# EAGLE design Altera_Sample_schematic (EAGLE 6.4)

## Sheet 1 of 5
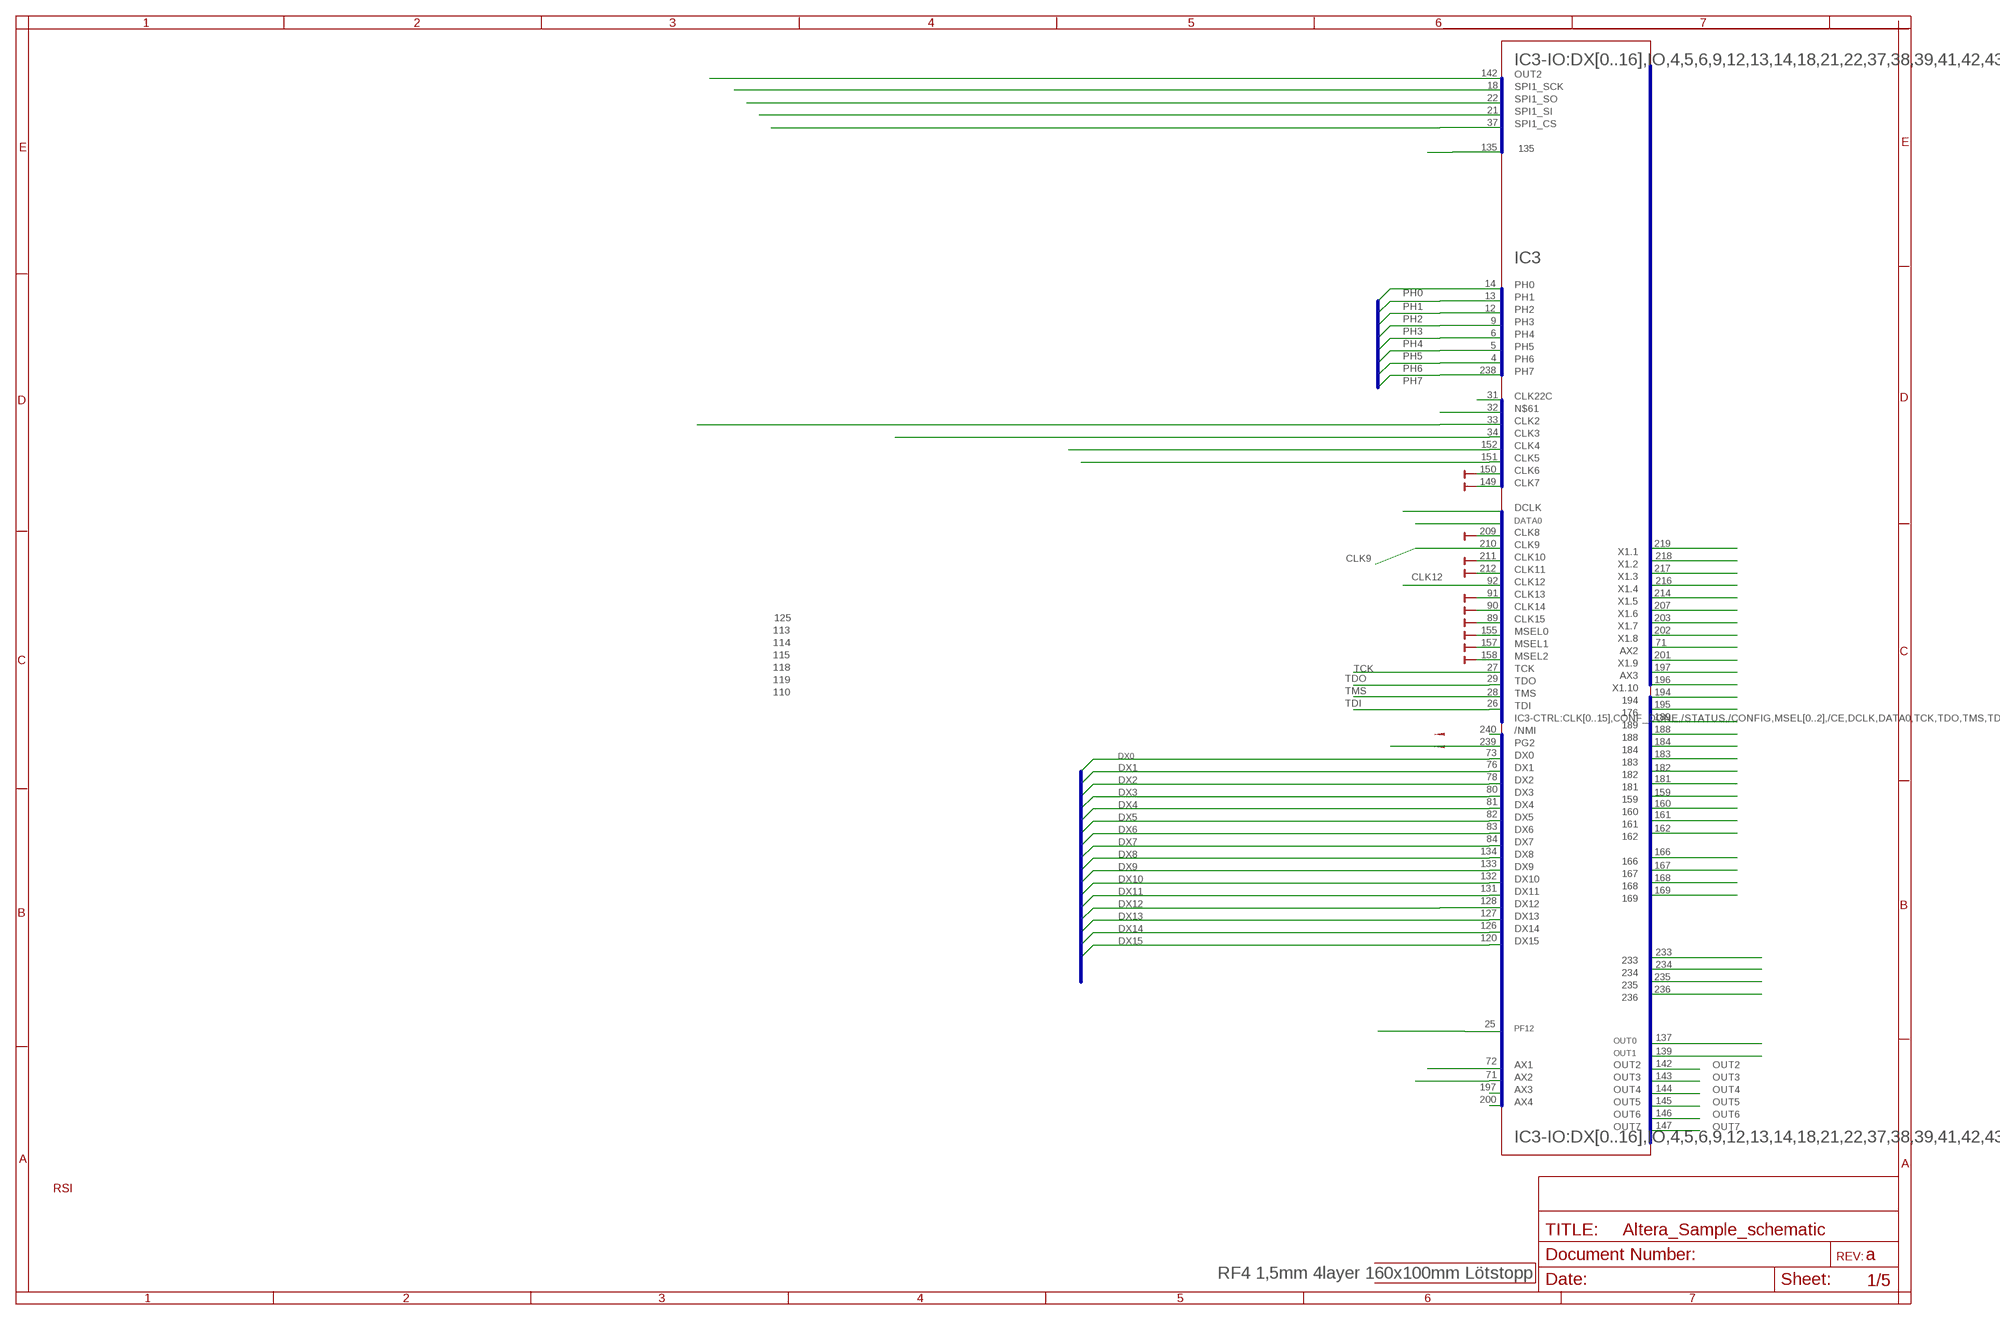
[diagram p0: schematic, sheet 1]

### Parts
PCB  RF4 1,5mm 4layer 160x100mm Lötstopp  PCB  [PCB]

### Buses
DATA:D[0..15]
SPI1:CS,SCK,SI,SO,PH[0..7]
IC3-IO:DX[0..16],IO,4,5,6,9,12,13,14,18,21,22,37,38,39,41,42,43,44,45,46,49,50,51,52,55,56,57,63,64,65,68,69,70,71,72,73,76,78,80,81,82,83,84,87,88,93,94,95,98,99,100,103,106,107,108,109,110,111,112,113,114,117,118,119,120,126,127,128,131,132,133,134,135,137,139,142,148,159,160,161,162,164,166,167,168,169,171,173,176,177,181,182,183,184,185,186,187,188,189,194,195,196,197,200,201,202,203,207,214,216,217,218,219,221,223,224,226,230,231,232,233,234,235,236,237,238,239,240
IC3-CTRL:CLK[0..15],CONF_DONE,/STATUS,/CONFIG,MSEL[0..2],/CE,DCLK,DATA0,TCK,TDO,TMS,TDI
IC3-PH:PH[0..7]

### Notes on the sheet
- 142
- 18
- 22
- 21
- 37
- 135
- IC3
- 14
- 13
- 12
- 9
- 6
- 5
- 4
- 238
- 31
- 32
- 33
- 34
- 152
- 151
- 150
- 149
- 209
- 210 | 219
- 211 | 218
- 212 | 217
- 92 | 216
- 91 | 214
- 90 | 207
- 125 | 89 | 203
- 113 | 155 | 202
- 114 | 157 | 71
- 115 | 158 | 201
- 118 | 27 | 197
- 119 | 29 | 196
- 110 | 28 | 194
- 26 | 195
- 189
- 240 | 188
- 239 | 184
- 73 | 183
- 76
- 182
- 78 | 181
- 80
- 159
- 81 | 160
- 82 | 161
- 83 | 162
- 84
- 134 | 166
- 133 | 167
- 132 | 168
- 131 | 169
- 128
- 127
- 126
- 120
- 233
- 234
- 235
- 236
- 25
- 137
- 139
- 72 | 142
- 71 | 143
- 197 | 144
- 200 | 145
- 146
- 147
- RSI

## Sheet 2 of 5
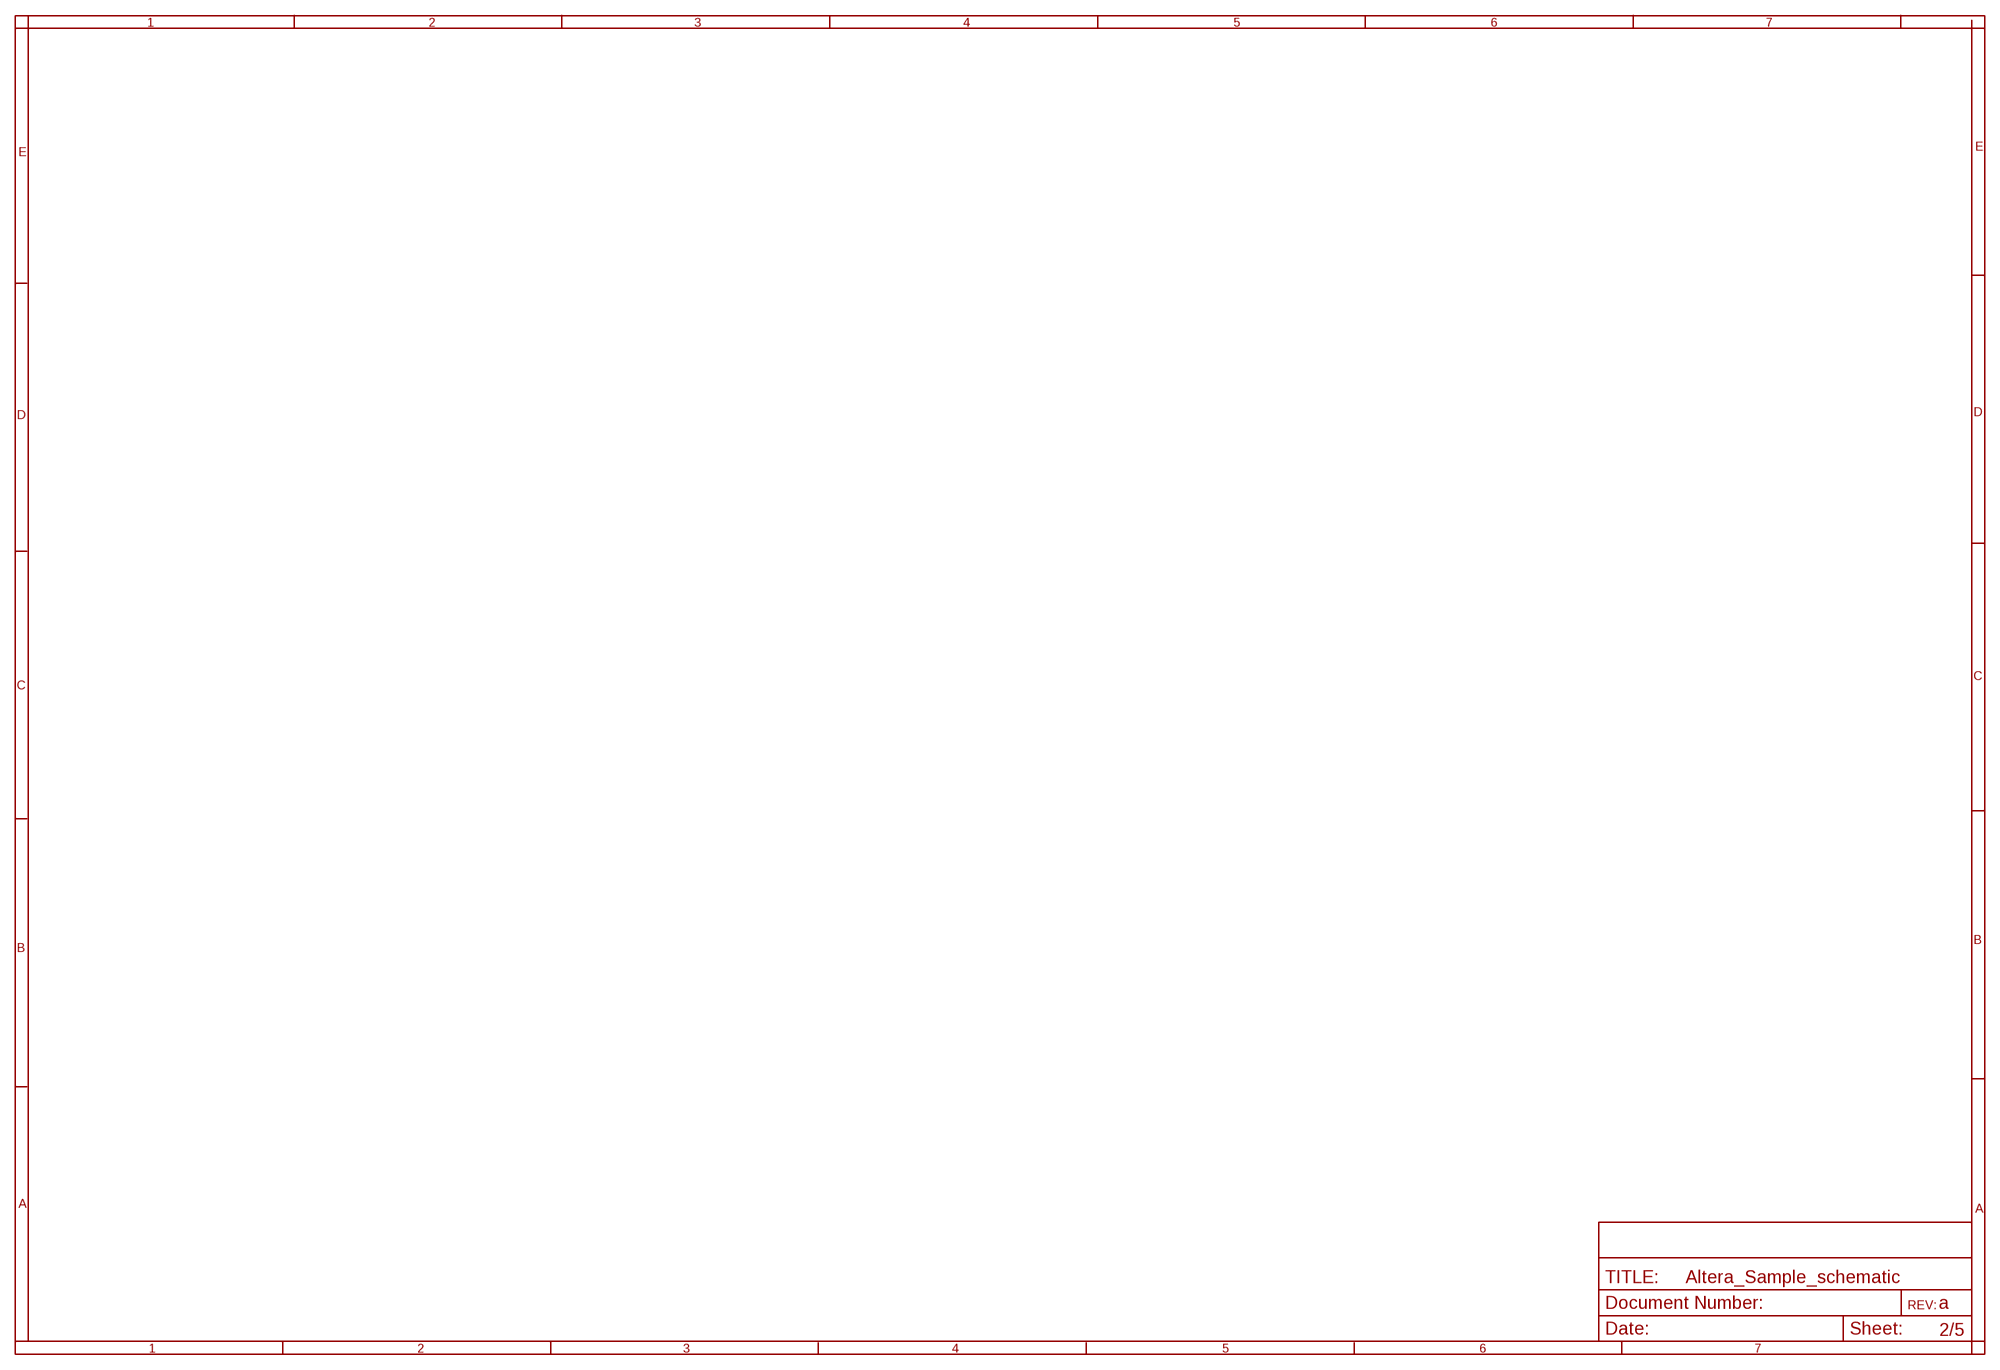
[diagram p1: schematic, sheet 2]

## Sheet 3 of 5
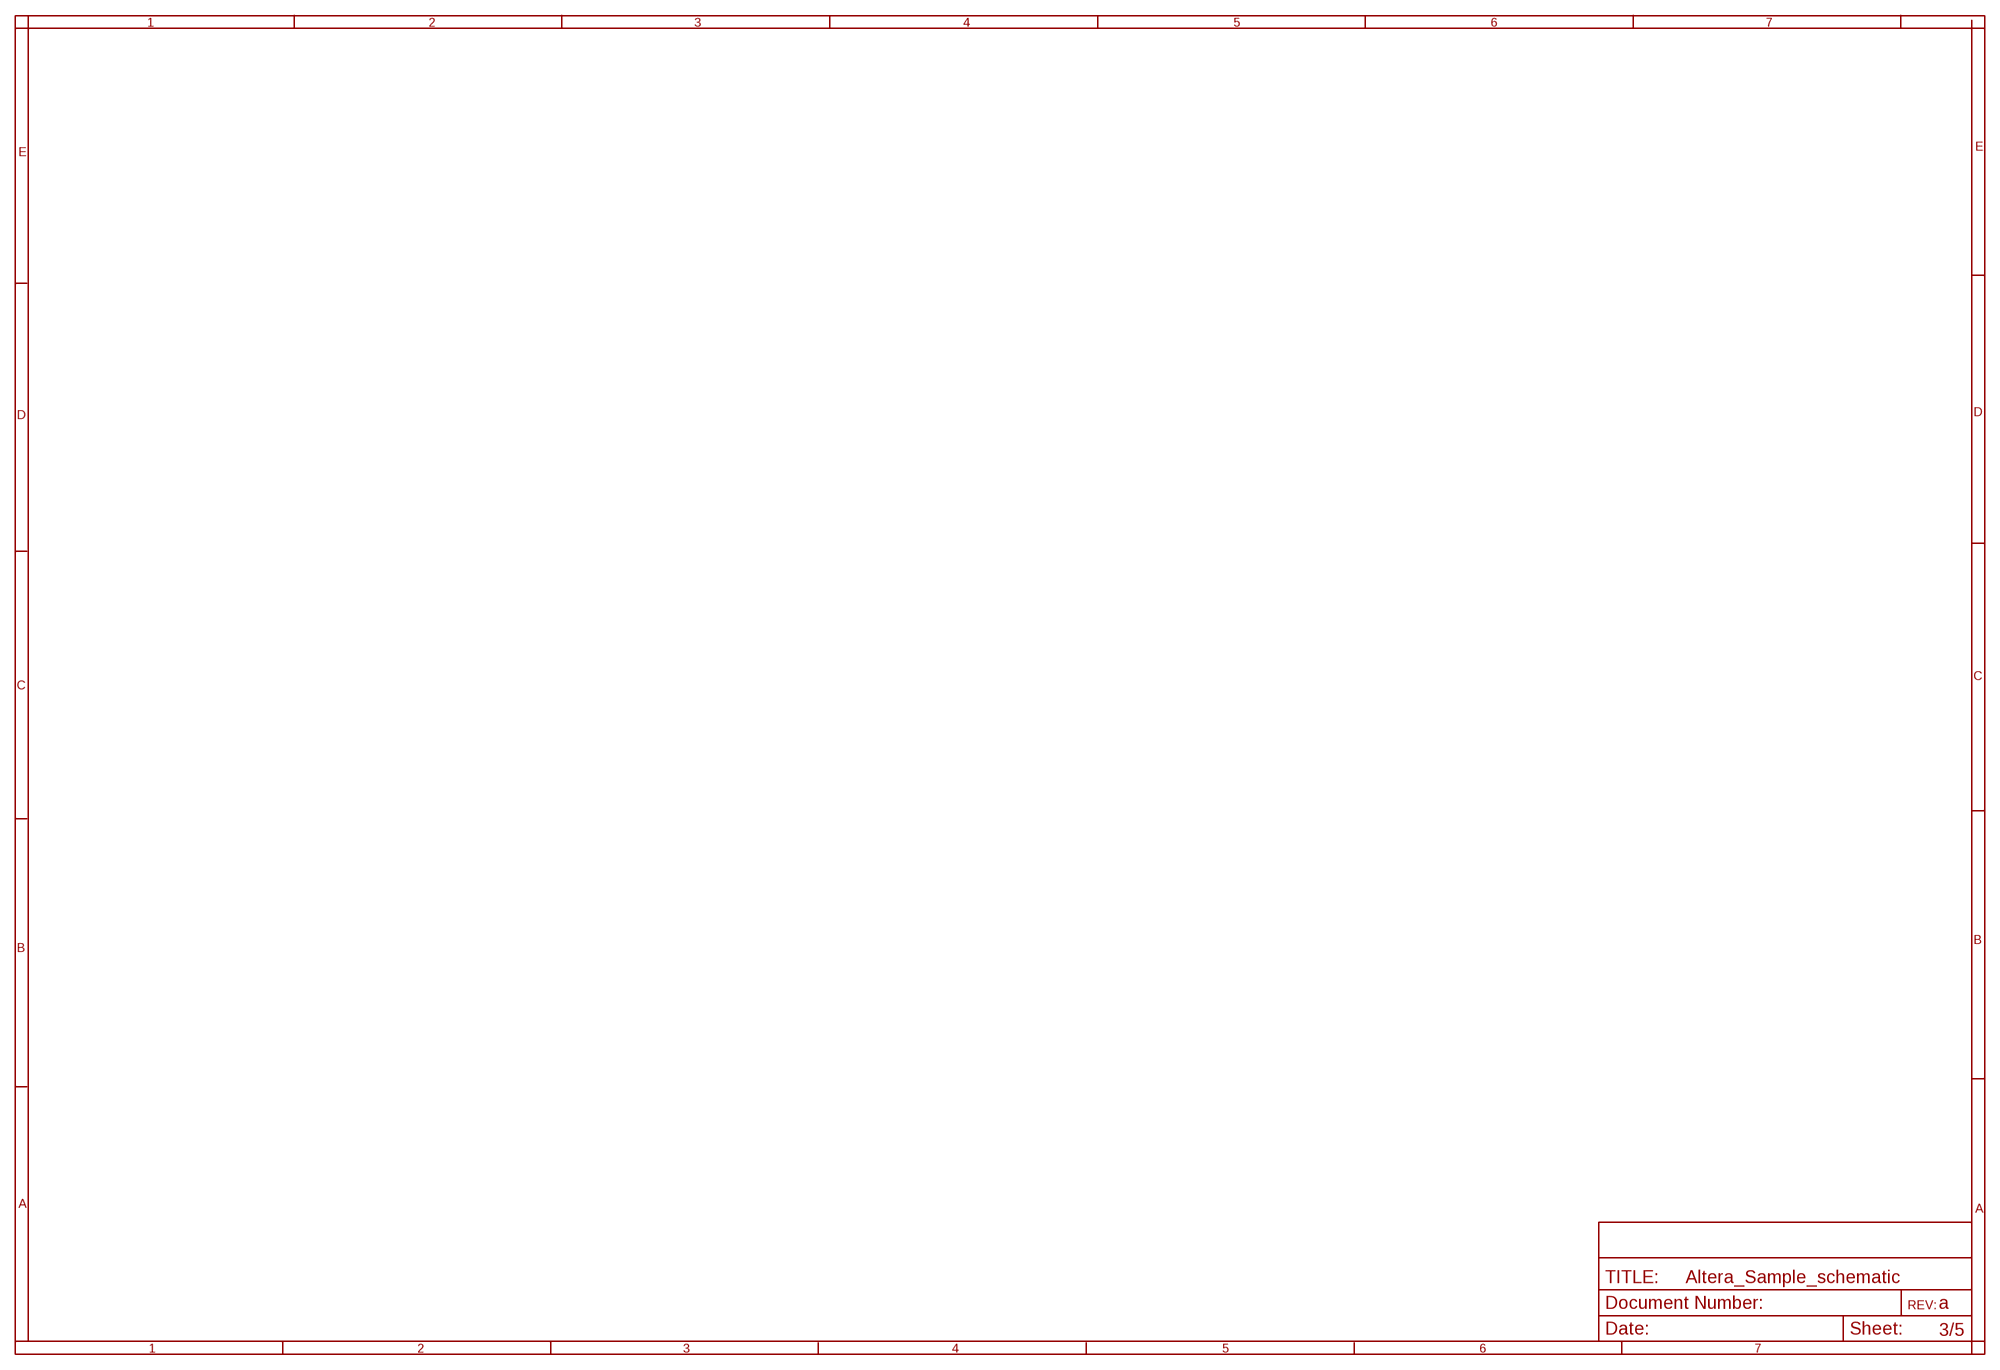
[diagram p2: schematic, sheet 3]

## Sheet 4 of 5
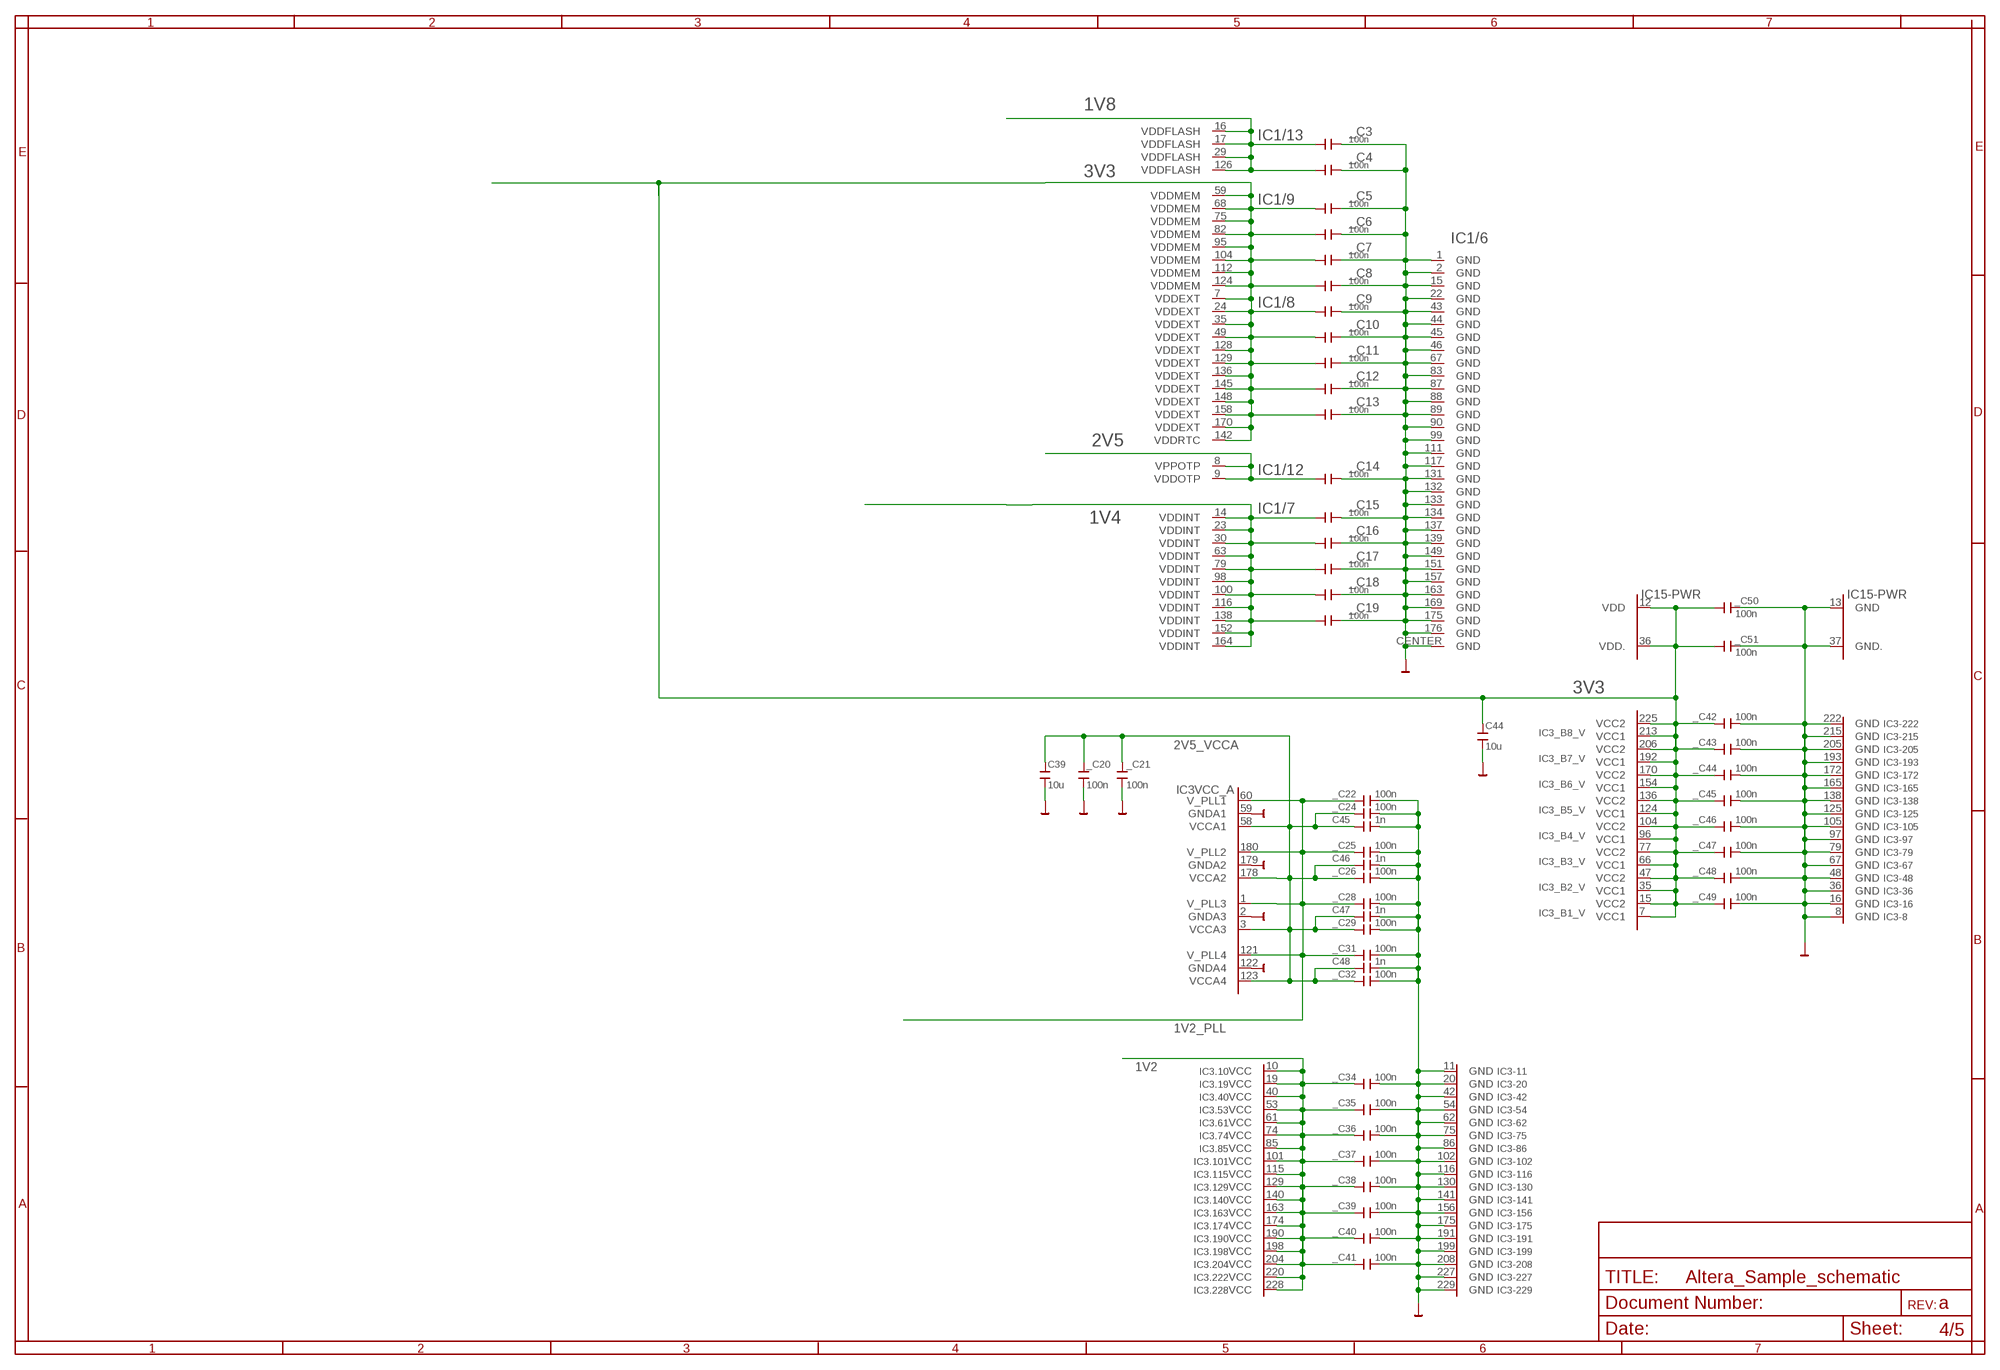
[diagram p3: schematic, sheet 4]

### Parts
_C3  100n  C-EUC0805  [C0805]
_C4  100n  C-EUC0805  [C0805]
_C5  100n  C-EUC0805  [C0805]
_C6  100n  C-EUC0805  [C0805]
_C7  100n  C-EUC0805  [C0805]
_C8  100n  C-EUC0805  [C0805]
_C9  100n  C-EUC0805  [C0805]
_C10  100n  C-EUC0805  [C0805]
_C11  100n  C-EUC0805  [C0805]
_C12  100n  C-EUC0805  [C0805]
_C13  100n  C-EUC0805  [C0805]
_C14  100n  C-EUC0805  [C0805]
_C15  100n  C-EUC0805  [C0805]
_C16  100n  C-EUC0805  [C0805]
_C17  100n  C-EUC0805  [C0805]
_C18  100n  C-EUC0805  [C0805]
_C19  100n  C-EUC0805  [C0805]
_C20  100n  C-EUC0805  [C0805]
_C21  100n  C-EUC0805  [C0805]
_C22  100n  C-EUC0805  [C0805]
_C24  100n  C-EUC0805  [C0805]
_C25  100n  C-EUC0805  [C0805]
_C26  100n  C-EUC0805  [C0805]
_C28  100n  C-EUC0805  [C0805]
_C29  100n  C-EUC0805  [C0805]
_C31  100n  C-EUC0805  [C0805]
_C32  100n  C-EUC0805  [C0805]
_C34  100n  C-EUC0805  [C0805]
_C35  100n  C-EUC0805  [C0805]
_C36  100n  C-EUC0805  [C0805]
_C37  100n  C-EUC0805  [C0805]
_C38  100n  C-EUC0805  [C0805]
_C39  100n  C-EUC0805  [C0805]
_C40  100n  C-EUC0805  [C0805]
_C41  100n  C-EUC0805  [C0805]
_C42  100n  C-EUC0805  [C0805]
_C43  100n  C-EUC0805  [C0805]
_C44  100n  C-EUC0805  [C0805]
_C45  100n  C-EUC0805  [C0805]
_C46  100n  C-EUC0805  [C0805]
_C47  100n  C-EUC0805  [C0805]
_C48  100n  C-EUC0805  [C0805]
_C49  100n  C-EUC0805  [C0805]
_C50  100n  C-EUC0805  [C0805]
_C51  100n  C-EUC0805  [C0805]
C39  10u  C-EUC1210K  [C1210K]
C44  10u  C-EUC1210K  [C1210K]
C45  1n  C-EUC0805  [C0805]
C46  1n  C-EUC0805  [C0805]
C47  1n  C-EUC0805  [C0805]
C48  1n  C-EUC0805  [C0805]
IC1  ADSP-BF514_PART  [LQFP-176+GND]
IC3  EP3C25-Q240-IO131  [PQFP240]
IC15  IS62WV102416ALL  [TSOP1-12X20]

### Nets
1V2: _C34.2 _C35.2 _C36.2 _C37.2 _C38.2 _C39.2 _C40.2 _C41.2 IC3.10(.10:VCC) IC3.19(.19:VCC) IC3.40(.40:VCC) IC3.53(.53:VCC) IC3.61(.61:VCC) IC3.74(.74:VCC) IC3.85(.85:VCC) IC3.101(.101:VCC) IC3.115(.115:VCC) IC3.129(.129:VCC) IC3.140(.140:VCC) IC3.163(.163:VCC) IC3.174(.174:VCC) IC3.190(.190:VCC) IC3.198(.198:VCC) IC3.204(.204:VCC) IC3.220(.222:VCC) IC3.228(.228:VCC)
1V2_PLL: _C22.2 _C25.2 _C28.2 _C31.2 IC3.1(VCC_A:V_PLL3) IC3.60(VCC_A:V_PLL1) IC3.121(VCC_A:V_PLL4) IC3.180(VCC_A:V_PLL2)
1V4: _C15.1 _C16.1 _C17.1 _C18.1 _C19.1 IC1.14(/7:VDDINT) IC1.23(/7:VDDINT) IC1.30(/7:VDDINT) IC1.63(/7:VDDINT) IC1.79(/7:VDDINT) IC1.98(/7:VDDINT) IC1.100(/7:VDDINT) IC1.116(/7:VDDINT) IC1.138(/7:VDDINT) IC1.152(/7:VDDINT) IC1.164(/7:VDDINT)
1V8: _C3.1 _C4.1 IC1.16(/13:VDDFLASH) IC1.17(/13:VDDFLASH) IC1.29(/13:VDDFLASH) IC1.126(/13:VDDFLASH)
2V5: _C14.1 IC1.8(/12:VPPOTP) IC1.9(/12:VDDOTP)
2V5_VCCA: _C20.2 _C21.2 _C24.2 _C26.2 _C29.2 _C32.2 C39.2 C45.2 C46.2 C47.2 C48.2 IC3.3(VCC_A:VCCA3) IC3.58(VCC_A:VCCA1) IC3.123(VCC_A:VCCA4) IC3.178(VCC_A:VCCA2)
3V3: _C5.1 _C6.1 _C7.1 _C8.1 _C9.1 _C10.1 _C11.1 _C12.1 _C13.1 _C42.2 _C43.2 _C44.2 _C45.2 _C46.2 _C47.2 _C48.2 _C49.2 _C50.1 _C51.1 C44.2 IC1.7(/8:VDDEXT) IC1.24(/8:VDDEXT) IC1.35(/8:VDDEXT) IC1.49(/8:VDDEXT) IC1.59(/9:VDDMEM) IC1.68(/9:VDDMEM) IC1.75(/9:VDDMEM) IC1.82(/9:VDDMEM) IC1.95(/9:VDDMEM) IC1.104(/9:VDDMEM) IC1.112(/9:VDDMEM) IC1.124(/9:VDDMEM) IC1.128(/8:VDDEXT) IC1.129(/8:VDDEXT) IC1.136(/8:VDDEXT) IC1.142(/12:VDDRTC) IC1.145(/8:VDDEXT) IC1.148(/8:VDDEXT) IC1.158(/8:VDDEXT) IC1.170(/8:VDDEXT) IC3.7(_B1_V:VCC1) IC3.15(_B1_V:VCC2) IC3.35(_B2_V:VCC1) IC3.47(_B2_V:VCC2) IC3.66(_B3_V:VCC1) IC3.77(_B3_V:VCC2) IC3.96(_B4_V:VCC1) IC3.104(_B4_V:VCC2) IC3.124(_B5_V:VCC1) IC3.136(_B5_V:VCC2) IC3.154(_B6_V:VCC1) IC3.170(_B6_V:VCC2) IC3.192(_B7_V:VCC1) IC3.206(_B7_V:VCC2) IC3.213(_B8_V:VCC1) IC3.225(_B8_V:VCC2) IC15.12(-PWR:VDD) IC15.36(-PWR:VDD.)
GND: _C3.2 _C4.2 _C5.2 _C6.2 _C7.2 _C8.2 _C9.2 _C10.2 _C11.2 _C12.2 _C13.2 _C14.2 _C15.2 _C16.2 _C17.2 _C18.2 _C19.2 _C20.1 _C21.1 _C22.1 _C24.1 _C25.1 _C26.1 _C28.1 _C29.1 _C31.1 _C32.1 _C34.1 _C35.1 _C36.1 _C37.1 _C38.1 _C39.1 _C40.1 _C41.1 _C42.1 _C43.1 _C44.1 _C45.1 _C46.1 _C47.1 _C48.1 _C49.1 _C50.2 _C51.2 C39.1 C44.1 C45.1 C46.1 C47.1 C48.1 IC1.1(/6:GND) IC1.2(/6:GND) IC1.15(/6:GND) IC1.22(/6:GND) IC1.43(/6:GND) IC1.44(/6:GND) IC1.45(/6:GND) IC1.46(/6:GND) IC1.67(/6:GND) IC1.83(/6:GND) IC1.87(/6:GND) IC1.88(/6:GND) IC1.89(/6:GND) IC1.90(/6:GND) IC1.99(/6:GND) IC1.111(/6:GND) IC1.117(/6:GND) IC1.131(/6:GND) IC1.132(/6:GND) IC1.133(/6:GND) IC1.134(/6:GND) IC1.137(/6:GND) IC1.139(/6:GND) IC1.149(/6:GND) IC1.151(/6:GND) IC1.157(/6:GND) IC1.163(/6:GND) IC1.169(/6:GND) IC1.175(/6:GND) IC1.176(/6:GND) IC1.CENTER(/6:GND) IC3.2(VCC_A:GNDA3) IC3.8(-8:GND) IC3.11(-11:GND) IC3.16(-16:GND) IC3.20(-20:GND) IC3.36(-36:GND) IC3.42(-42:GND) IC3.48(-48:GND) IC3.54(-54:GND) IC3.59(VCC_A:GNDA1) IC3.62(-62:GND) IC3.67(-67:GND) IC3.75(-75:GND) IC3.79(-79:GND) IC3.86(-86:GND) IC3.97(-97:GND) IC3.102(-102:GND) IC3.105(-105:GND) IC3.116(-116:GND) IC3.122(VCC_A:GNDA4) IC3.125(-125:GND) IC3.130(-130:GND) IC3.138(-138:GND) IC3.141(-141:GND) IC3.156(-156:GND) IC3.165(-165:GND) IC3.172(-172:GND) IC3.175(-175:GND) IC3.179(VCC_A:GNDA2) IC3.191(-191:GND) IC3.193(-193:GND) IC3.199(-199:GND) IC3.205(-205:GND) IC3.208(-208:GND) IC3.215(-215:GND) IC3.222(-222:GND) IC3.227(-227:GND) IC3.229(-229:GND) IC15.13(-PWR:GND) IC15.37(-PWR:GND.) ; also sheet 5
Unconnected: IC1.3(/3:PF9) IC1.4(/3:PF8) IC1.5(/3:PF7) IC1.6(/3:PF6) IC1.10(/3:PF5) IC1.11(/3:PF4) IC1.12(/3:PF3) IC1.13(/3:PF2) IC1.18(/3:PF1) IC1.19(/3:PF0) IC1.20(/4:PG15) IC1.21(/4:PG14) IC1.25(/4:PG13) IC1.26(/4:PG12) IC1.27(/4:PG11) IC1.28(/4:PG10) IC1.31(/4:PG9) IC1.32(/4:PG8) IC1.33(/4:PG7) IC1.34(/4:PG6) IC1.36(/4:PG5) IC1.37(/4:PG4) IC1.38(/4:PG3) IC1.39(/4:PG2) IC1.47(/4:PG1) IC1.48(/4:PG0) IC1.50(/11:TDO) IC1.51(/11:/EMU) IC1.52(/11:TDI) IC1.53(/11:TCK) IC1.54(/11:/TRST) IC1.55(/11:TMS) IC1.56(/2:D15) IC1.57(/2:D14) IC1.58(/2:D13) IC1.60(/2:D12) IC1.61(/2:D11) IC1.62(/2:D10) IC1.64(/2:D9) IC1.65(/2:D8) IC1.66(/2:D7) IC1.69(/2:D6) IC1.70(/2:D5) IC1.71(/2:D4) IC1.72(/2:D3) IC1.73(/2:D2) IC1.74(/2:D1) IC1.76(/2:D0) IC1.77(/1:A19) IC1.78(/1:A18) IC1.80(/1:A17) IC1.81(/1:A16) IC1.84(/1:A15) IC1.85(/1:A14) IC1.86(/1:A13) IC1.91(/1:A12) IC1.92(/1:A11) IC1.93(/1:A10) IC1.94(/1:A9) IC1.96(/1:A8) IC1.97(/1:A7) IC1.101(/1:A6) IC1.102(/1:A5) IC1.103(/1:A4) IC1.105(/1:A3) IC1.106(/1:A2) IC1.107(/1:A1) IC1.108(/11:/ABE1) IC1.109(/11:/ABE0) IC1.110(/11:SA10) IC1.113(/11:/SWE) IC1.114(/11:/SCAS) IC1.115(/11:/SRAS) IC1.118(/11:/SMS) IC1.119(/11:SCKE) IC1.120(/11:/AMS1) IC1.121(/11:/ARE) IC1.122(/11:/AWE) IC1.123(/11:/AMS0) IC1.125(/11:CLKOUT) IC1.127(/11:NC) IC1.130(/11:EXT_WAKE) IC1.135(/11:/PG) IC1.140(/11:RTXO) IC1.141(/11:RTXI) IC1.143(/11:CLKIN) IC1.144(/11:XTAL) IC1.146(/11:/RESET) IC1.147(/11:/NMI) IC1.150(/11:CLKBUF) IC1.153(/5:PH7) IC1.154(/5:PH6) IC1.155(/5:PH5) IC1.156(/5:PH4) IC1.159(/5:PH3) IC1.160(/5:PH2) IC1.161(/5:PH1) IC1.162(/5:PH0) IC1.165(/3:PF15) IC1.166(/3:PF14) IC1.167(/3:PF13) IC1.168(/3:PF12) IC1.171(/3:PF11) IC1.172(/11:SDA) IC1.173(/11:SCL) IC1.174(/3:PF10)

### Notes on the sheet
- IC1/13
- IC1/9
- IC1/6
- IC1/8
- IC1/12
- IC1/7

## Sheet 5 of 5
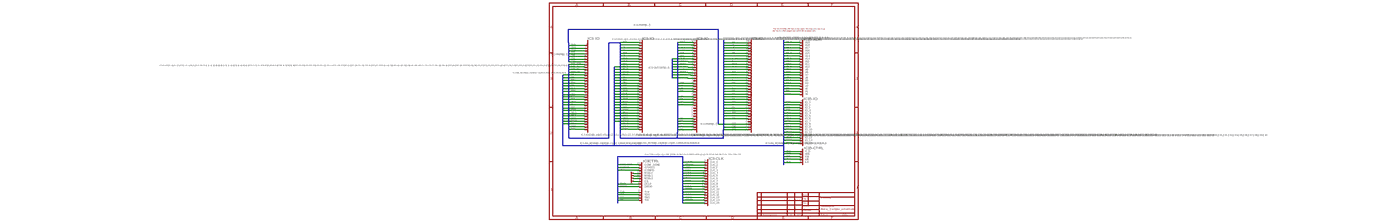
[diagram p4: schematic, sheet 5, overview]
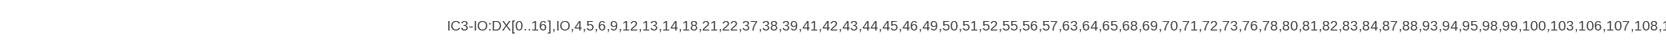
[diagram p5: schematic, sheet 5, part 1 of 4]
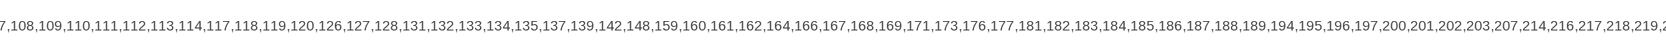
[diagram p6: schematic, sheet 5, part 2 of 4]
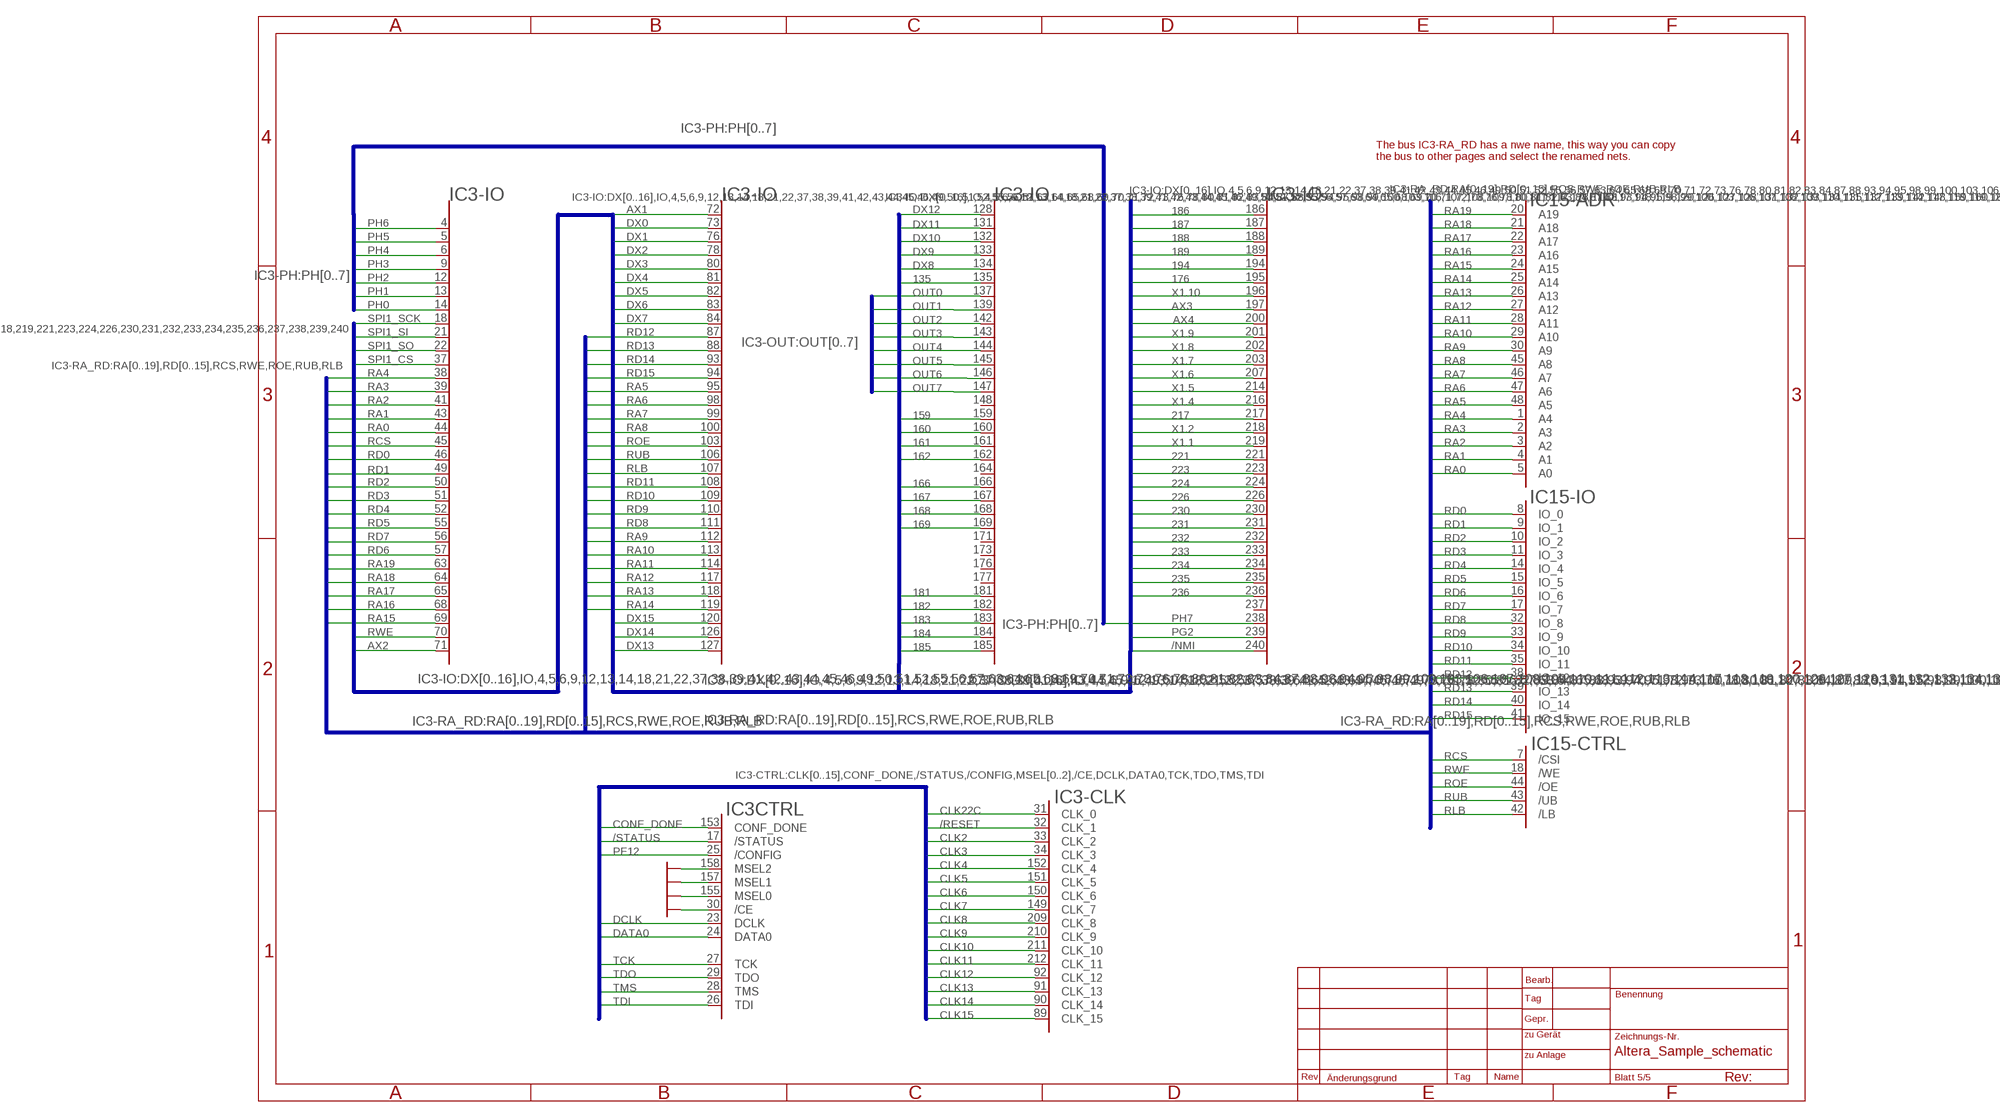
[diagram p7: schematic, sheet 5, part 3 of 4]
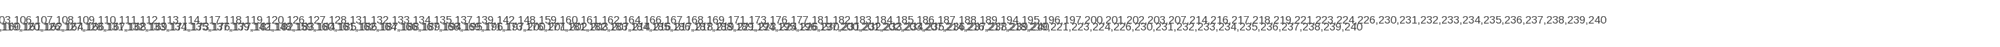
[diagram p8: schematic, sheet 5, part 4 of 4]

### Nets
135: IC3.135(IO_71) ; also sheet 1
159: IC3.159(IO_81) ; also sheet 1
160: IC3.160(IO_82) ; also sheet 1
161: IC3.161(IO_83) ; also sheet 1
162: IC3.162(IO_84) ; also sheet 1
166: IC3.166(IO_86) ; also sheet 1
167: IC3.167(IO_87) ; also sheet 1
168: IC3.168(IO_88) ; also sheet 1
169: IC3.169(IO_89) ; also sheet 1
176: IC3.195(IO_104) ; also sheet 1
181: IC3.181(IO_94) ; also sheet 1
182: IC3.182(IO_95) ; also sheet 1
183: IC3.183(IO_96) ; also sheet 1
184: IC3.184(IO_97) ; also sheet 1
185: IC3.185(IO_98)
186: IC3.186(IO_99)
187: IC3.187(IO_100)
188: IC3.188(IO_101) ; also sheet 1
189: IC3.189(IO_102) ; also sheet 1
194: IC3.194(IO_103) ; also sheet 1
217: IC3.217(IO_114)
221: IC3.221(IO_117)
223: IC3.223(IO_118)
224: IC3.224(IO_119)
226: IC3.226(IO_120)
230: IC3.230(IO_121)
231: IC3.231(IO_122)
232: IC3.232(IO_123)
233: IC3.233(IO_124) ; also sheet 1
234: IC3.234(IO_125) ; also sheet 1
235: IC3.235(IO_126) ; also sheet 1
236: IC3.236(IO_127) ; also sheet 1
/NMI: IC3.240(IO_131) ; also sheet 1
/RESET: IC3.32(-CLK:CLK_1)
/STATUS: IC3.17(CTRL:/STATUS)
AX1: IC3.72(IO_33) ; also sheet 1
AX2: IC3.71(IO_32) ; also sheet 1
AX3: IC3.197(IO_106) ; also sheet 1
AX4: IC3.200(IO_107) ; also sheet 1
CLK2: IC3.33(-CLK:CLK_2) ; also sheet 1
CLK3: IC3.34(-CLK:CLK_3) ; also sheet 1
CLK4: IC3.152(-CLK:CLK_4) ; also sheet 1
CLK5: IC3.151(-CLK:CLK_5) ; also sheet 1
CLK6: IC3.150(-CLK:CLK_6) ; also sheet 1
CLK7: IC3.149(-CLK:CLK_7) ; also sheet 1
CLK8: IC3.209(-CLK:CLK_8) ; also sheet 1
CLK9: IC3.210(-CLK:CLK_9) ; also sheet 1
CLK10: IC3.211(-CLK:CLK_10) ; also sheet 1
CLK11: IC3.212(-CLK:CLK_11) ; also sheet 1
CLK12: IC3.92(-CLK:CLK_12) ; also sheet 1
CLK13: IC3.91(-CLK:CLK_13) ; also sheet 1
CLK14: IC3.90(-CLK:CLK_14) ; also sheet 1
CLK15: IC3.89(-CLK:CLK_15) ; also sheet 1
CLK22C: IC3.31(-CLK:CLK_0) ; also sheet 1
CONF_DONE: IC3.153(CTRL:CONF_DONE)
DATA0: IC3.24(CTRL:DATA0) ; also sheet 1
DCLK: IC3.23(CTRL:DCLK) ; also sheet 1
DX0: IC3.73(IO_34) ; also sheet 1
DX1: IC3.76(IO_35) ; also sheet 1
DX2: IC3.78(IO_36) ; also sheet 1
DX3: IC3.80(IO_37) ; also sheet 1
DX4: IC3.81(IO_38) ; also sheet 1
DX5: IC3.82(IO_39) ; also sheet 1
DX6: IC3.83(IO_40) ; also sheet 1
DX7: IC3.84(IO_41) ; also sheet 1
DX8: IC3.134(IO_70) ; also sheet 1
DX9: IC3.133(IO_69) ; also sheet 1
DX10: IC3.132(IO_68) ; also sheet 1
DX11: IC3.131(IO_67) ; also sheet 1
DX12: IC3.128(IO_66) ; also sheet 1
DX13: IC3.127(IO_65) ; also sheet 1
DX14: IC3.126(IO_64) ; also sheet 1
DX15: IC3.120(IO_63) ; also sheet 1
GND: IC3.30(CTRL:/CE) IC3.155(CTRL:MSEL0) IC3.157(CTRL:MSEL1) IC3.158(CTRL:MSEL2) ; also sheet 4
OUT0: IC3.137(IO_72) ; also sheet 1
OUT1: IC3.139(IO_73) ; also sheet 1
OUT2: IC3.142(IO_74) ; also sheet 1
OUT3: IC3.143(IO_75) ; also sheet 1
OUT4: IC3.144(IO_76) ; also sheet 1
OUT5: IC3.145(IO_77) ; also sheet 1
OUT6: IC3.146(IO_78) ; also sheet 1
OUT7: IC3.147(IO_79) ; also sheet 1
PF12: IC3.25(CTRL:/CONFIG) ; also sheet 1
PG2: IC3.239(IO_130) ; also sheet 1
PH0: IC3.14(IO_7) ; also sheet 1
PH1: IC3.13(IO_6) ; also sheet 1
PH2: IC3.12(IO_5) ; also sheet 1
PH3: IC3.9(IO_4) ; also sheet 1
PH4: IC3.6(IO_3) ; also sheet 1
PH5: IC3.5(IO_2) ; also sheet 1
PH6: IC3.4(IO_1) ; also sheet 1
PH7: IC3.238(IO_129) ; also sheet 1
RA0: IC3.44(IO_16) IC15.5(-ADR:A0)
RA1: IC3.43(IO_15) IC15.4(-ADR:A1)
RA2: IC3.41(IO_14) IC15.3(-ADR:A2)
RA3: IC3.39(IO_13) IC15.2(-ADR:A3)
RA4: IC3.38(IO_12) IC15.1(-ADR:A4)
RA5: IC3.95(IO_46) IC15.48(-ADR:A5)
RA6: IC3.98(IO_47) IC15.47(-ADR:A6)
RA7: IC3.99(IO_48) IC15.46(-ADR:A7)
RA8: IC3.100(IO_49) IC15.45(-ADR:A8)
RA9: IC3.112(IO_57) IC15.30(-ADR:A9)
RA10: IC3.113(IO_58) IC15.29(-ADR:A10)
RA11: IC3.114(IO_59) IC15.28(-ADR:A11)
RA12: IC3.117(IO_60) IC15.27(-ADR:A12)
RA13: IC3.118(IO_61) IC15.26(-ADR:A13)
RA14: IC3.119(IO_62) IC15.25(-ADR:A14)
RA15: IC3.69(IO_30) IC15.24(-ADR:A15)
RA16: IC3.68(IO_29) IC15.23(-ADR:A16)
RA17: IC3.65(IO_28) IC15.22(-ADR:A17)
RA18: IC3.64(IO_27) IC15.21(-ADR:A18)
RA19: IC3.63(IO_26) IC15.20(-ADR:A19)
RCS: IC3.45(IO_17) IC15.7(-CTRL:/CSI)
RD0: IC3.46(IO_18) IC15.8(-IO:IO_0)
RD1: IC3.49(IO_19) IC15.9(-IO:IO_1)
RD2: IC3.50(IO_20) IC15.10(-IO:IO_2)
RD3: IC3.51(IO_21) IC15.11(-IO:IO_3)
RD4: IC3.52(IO_22) IC15.14(-IO:IO_4)
RD5: IC3.55(IO_23) IC15.15(-IO:IO_5)
RD6: IC3.57(IO_25) IC15.16(-IO:IO_6)
RD7: IC3.56(IO_24) IC15.17(-IO:IO_7)
RD8: IC3.111(IO_56) IC15.32(-IO:IO_8)
RD9: IC3.110(IO_55) IC15.33(-IO:IO_9)
RD10: IC3.109(IO_54) IC15.34(-IO:IO_10)
RD11: IC3.108(IO_53) IC15.35(-IO:IO_11)
RD12: IC3.87(IO_42) IC15.38(-IO:IO_12)
RD13: IC3.88(IO_43) IC15.39(-IO:IO_13)
RD14: IC3.93(IO_44) IC15.40(-IO:IO_14)
RD15: IC3.94(IO_45) IC15.41(-IO:IO_15)
RLB: IC3.107(IO_52) IC15.42(-CTRL:/LB)
ROE: IC3.103(IO_50) IC15.44(-CTRL:/OE)
RUB: IC3.106(IO_51) IC15.43(-CTRL:/UB)
RWE: IC3.70(IO_31) IC15.18(-CTRL:/WE)
SPI1_CS: IC3.37(IO_11) ; also sheet 1
SPI1_SCK: IC3.18(IO_8) ; also sheet 1
SPI1_SI: IC3.21(IO_9) ; also sheet 1
SPI1_SO: IC3.22(IO_10) ; also sheet 1
TCK: IC3.27(CTRL:TCK) ; also sheet 1
TDI: IC3.26(CTRL:TDI) ; also sheet 1
TDO: IC3.29(CTRL:TDO) ; also sheet 1
TMS: IC3.28(CTRL:TMS) ; also sheet 1
X1.1: IC3.219(IO_116) ; also sheet 1
X1.2: IC3.218(IO_115) ; also sheet 1
X1.4: IC3.216(IO_113) ; also sheet 1
X1.5: IC3.214(IO_112) ; also sheet 1
X1.6: IC3.207(IO_111) ; also sheet 1
X1.7: IC3.203(IO_110) ; also sheet 1
X1.8: IC3.202(IO_109) ; also sheet 1
X1.9: IC3.201(IO_108) ; also sheet 1
X1.10: IC3.196(IO_105) ; also sheet 1
Unconnected: IC3.148(IO_80) IC3.164(IO_85) IC3.171(IO_90) IC3.173(IO_91) IC3.176(IO_92) IC3.177(IO_93) IC3.237(IO_128)

### Buses
IC3-IO:DX[0..16],IO,4,5,6,9,12,13,14,18,21,22,37,38,39,41,42,43,44,45,46,49,50,51,52,55,56,57,63,64,65,68,69,70,71,72,73,76,78,80,81,82,83,84,87,88,93,94,95,98,99,100,103,106,107,108,109,110,111,112,113,114,117,118,119,120,126,127,128,131,132,133,134,135,137,139,142,148,159,160,161,162,164,166,167,168,169,171,173,176,177,181,182,183,184,185,186,187,188,189,194,195,196,197,200,201,202,203,207,214,216,217,218,219,221,223,224,226,230,231,232,233,234,235,236,237,238,239,240
IC3-CTRL:CLK[0..15],CONF_DONE,/STATUS,/CONFIG,MSEL[0..2],/CE,DCLK,DATA0,TCK,TDO,TMS,TDI
IC3-PH:PH[0..7]
IC3-OUT:OUT[0..7]
IC3-RA_RD:RA[0..19],RD[0..15],RCS,RWE,ROE,RUB,RLB

### Notes on the sheet
- The bus IC3-RA_RD has a nwe name, this way you can copy 
  the bus to other pages and select the renamed nets.
- IC3-IO | IC3-IO | IC3-IO | IC3-IO

## Power pins joined to a net without a drawn wire
BMODE0: IC1.42(/10:BMODE0)
BMODE1: IC1.41(/10:BMODE1)
BMODE2: IC1.40(/10:BMODE2)

## Library data of the parts
_C3-_C22 _C24-_C26 _C28 _C29 _C31 _C32 _C34-_C51 C39 C44-C48 = rcl:C-EU: CAPACITOR, European symbol
IC1 = sastec:ADSP-BF514_PART
IC3 = sastec:EP3C25-Q240-IO131: EPF10K30 FLEX 10K family; BUS-CTRL: -CTRL:CLK[0..15],CONF_DONE,/STATUS,/CONFIG,MSEL[0..2],/CE,DCLK,DATA0,TCK,TDO,TMS,TDI; BUS-IO: -IO:PIN#,4,5,6,9,12,13,14,18,21,22,37,38,39,41,42,43,44,45,46,49,50,51,52,55,56,57,63,64,65,68,69,70,71,72,73,76,78,80,81,82,83,84,87,88,93,94,95,98,99,100,103,106,107,108,109,110,111,112,113,114,117,118,119,120,126,127,128,131,132,133,134,135,137,139,142,148,159,160,161,162,164,166,167,168,169,171,173,176,177,181,182,183,184,185,186,187,188,189,194,195,196,197,200,201,202,203,207,214,216,217,218,219,221,223,224,226,230,231,232,233,234,235,236,237,238,239,240
IC15 = sastec:IS62WV102416ALL
PCB = frames:PCB

## Board
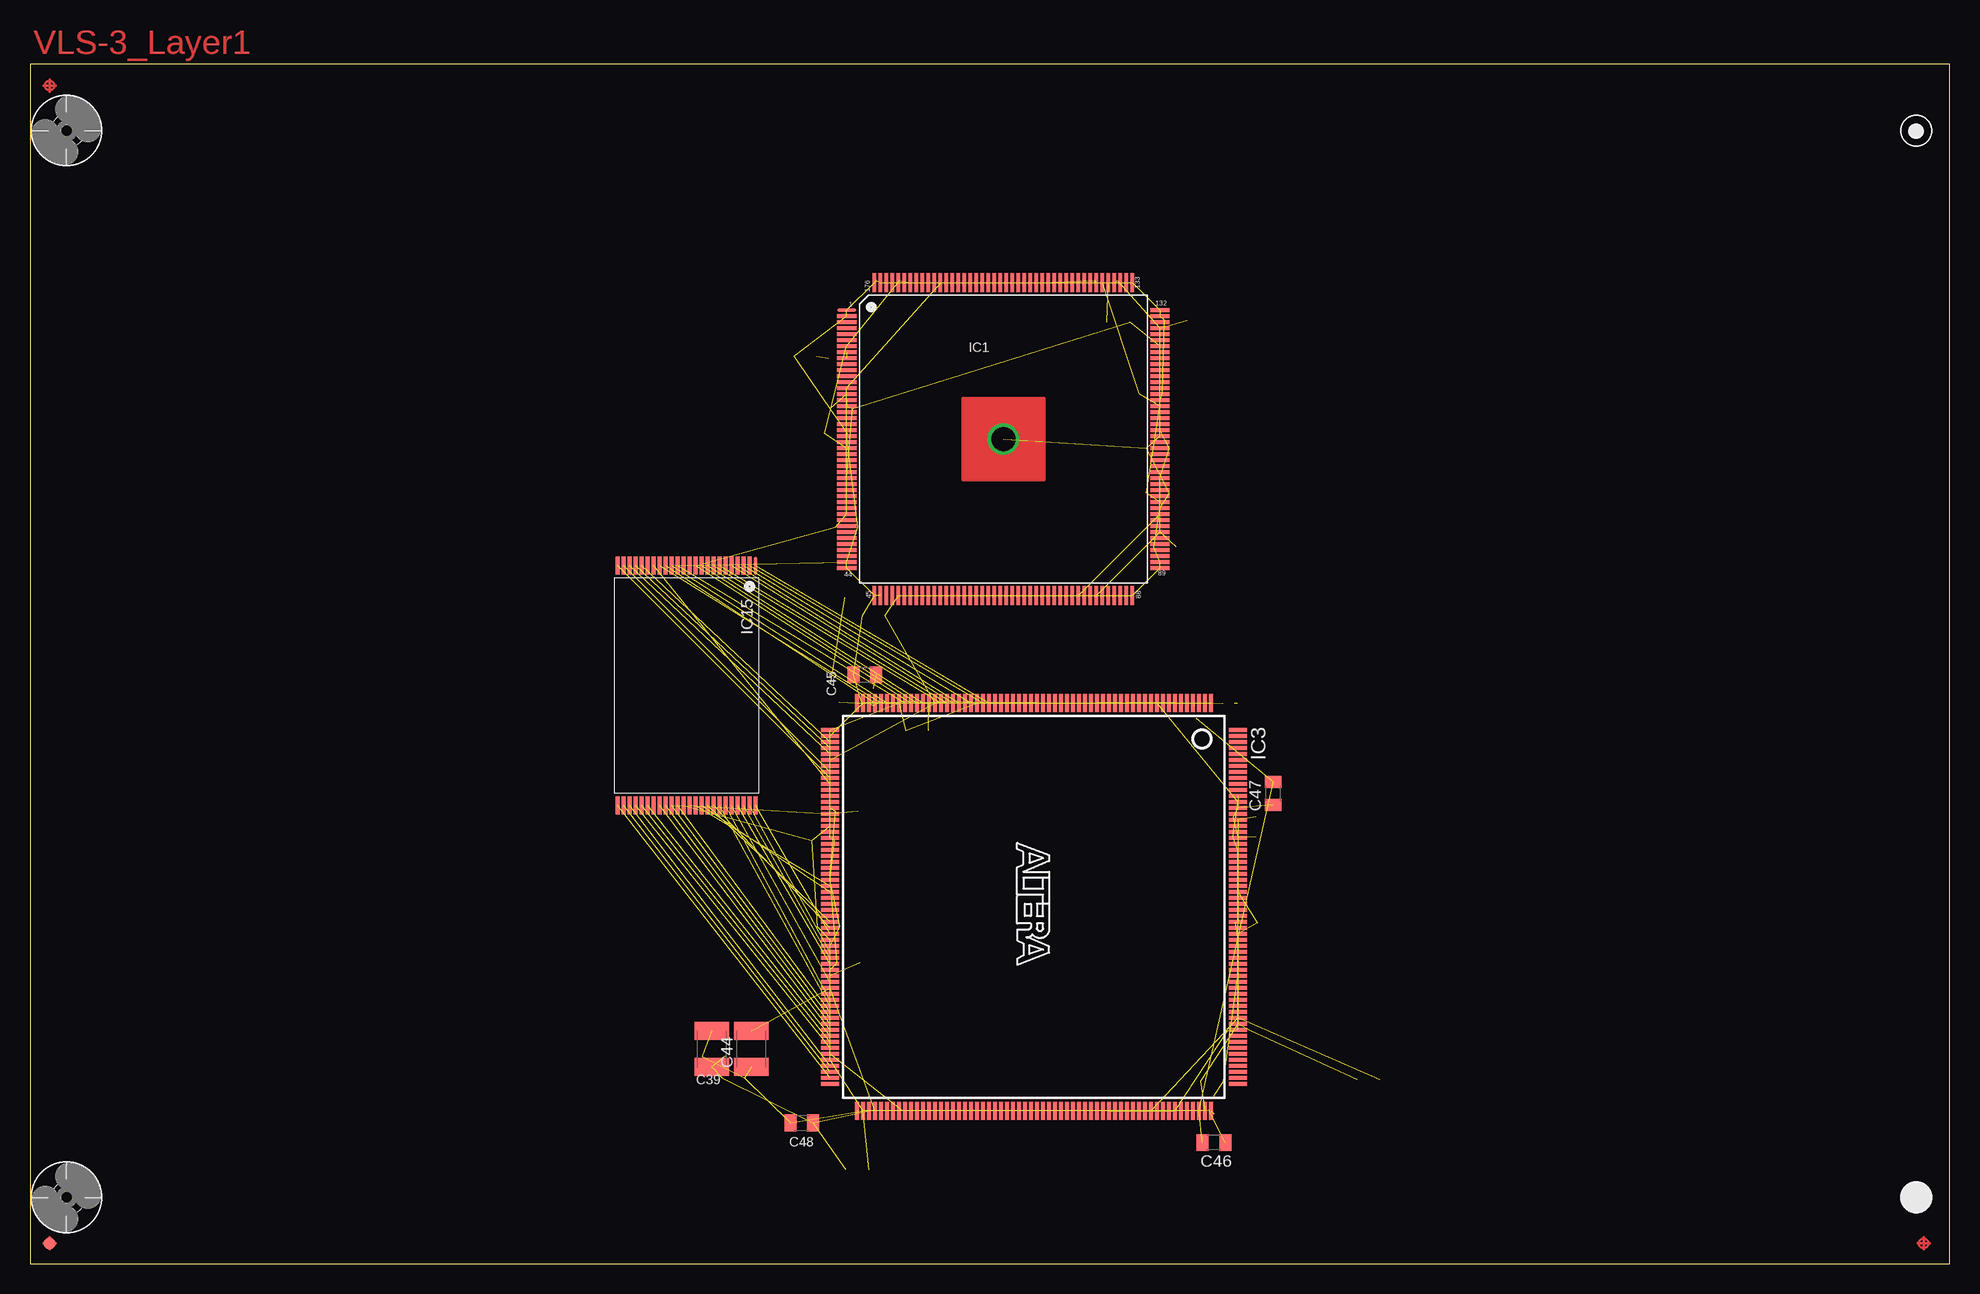
[diagram p9: board, top side]
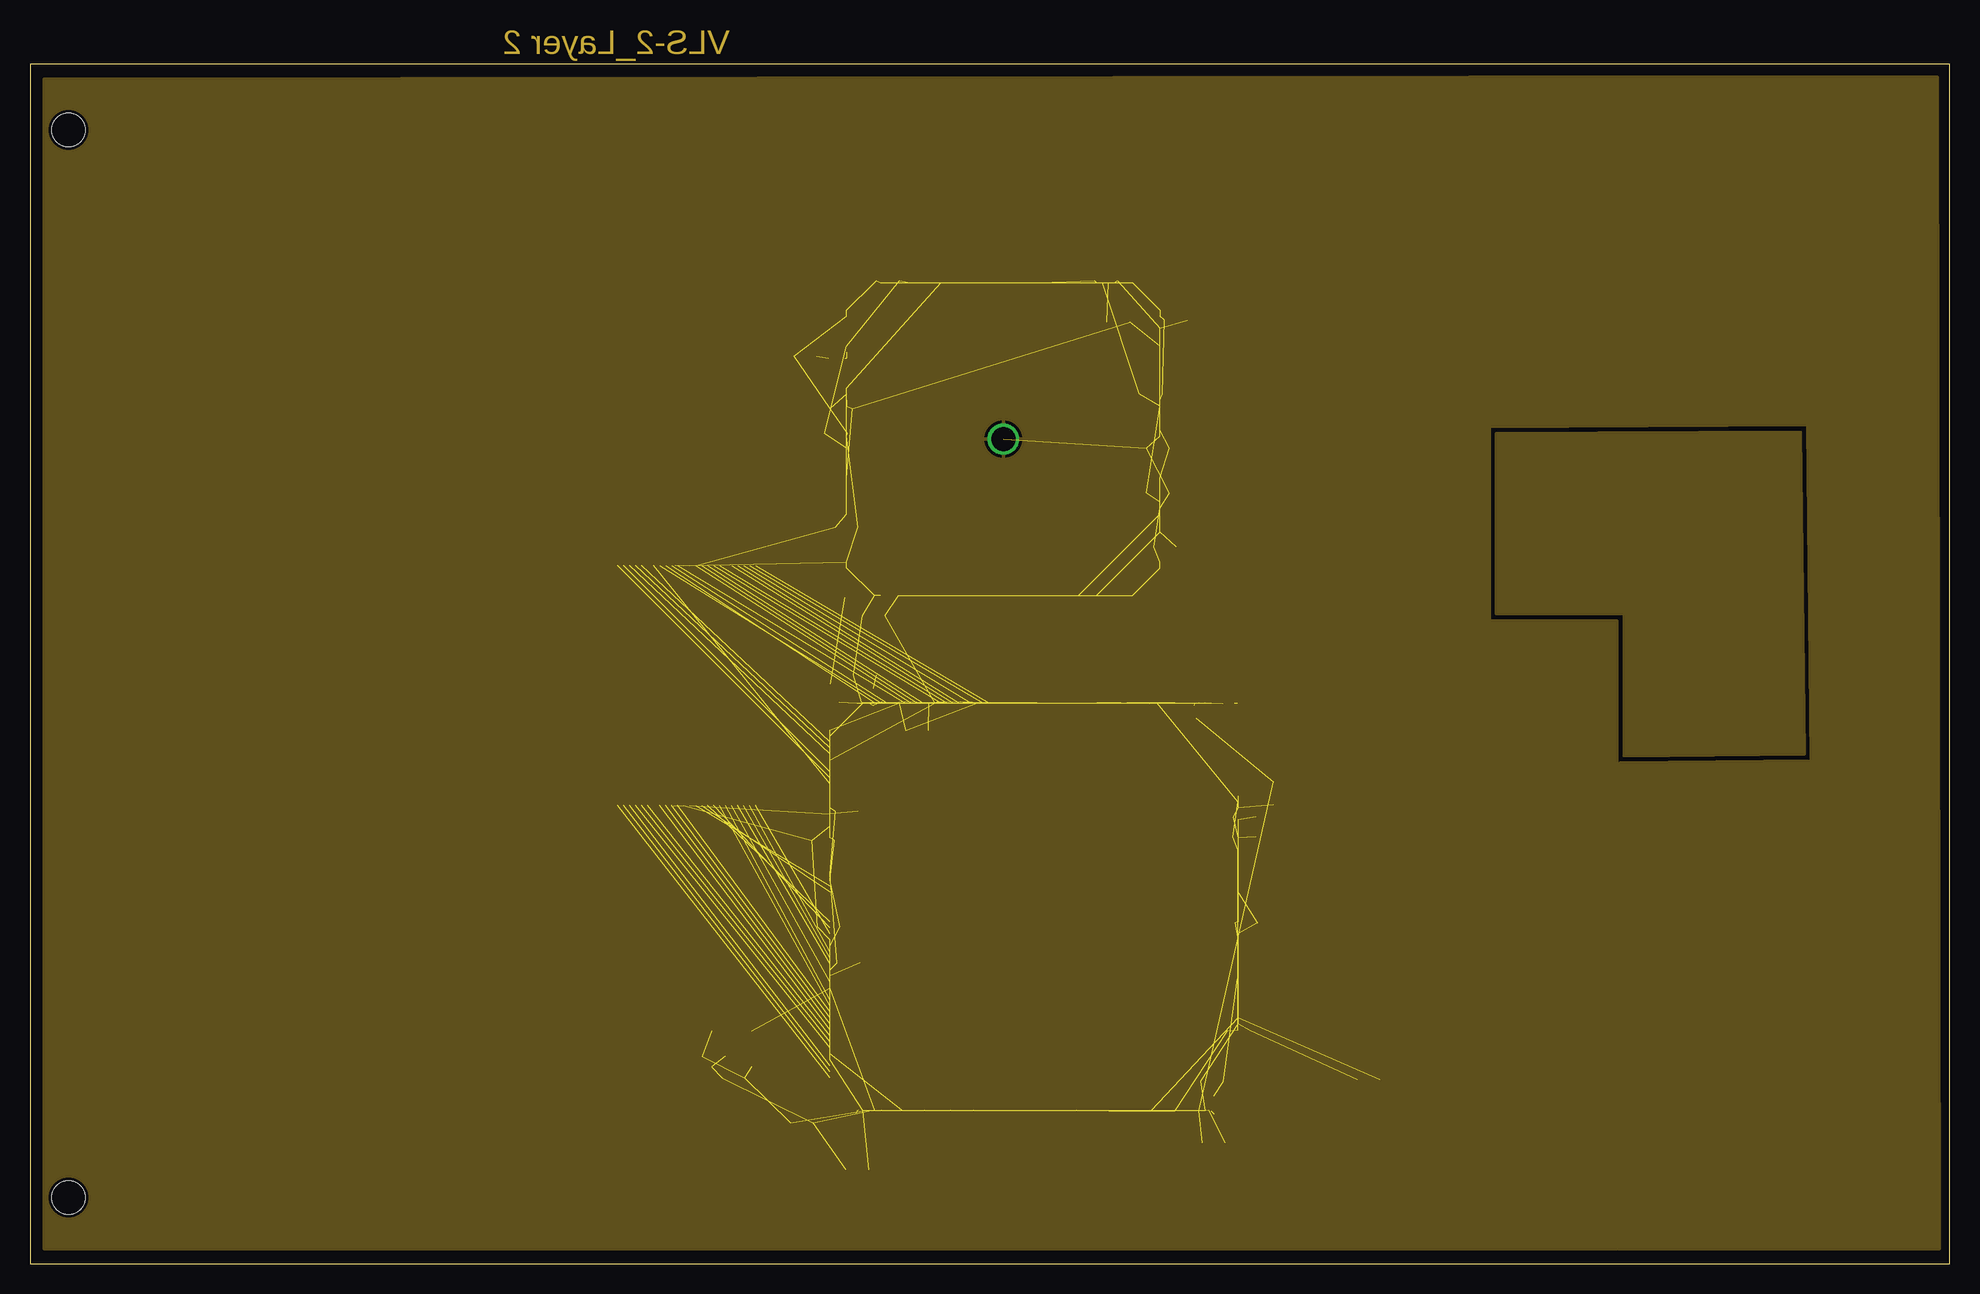
[diagram p10: board, inner layer Route2]
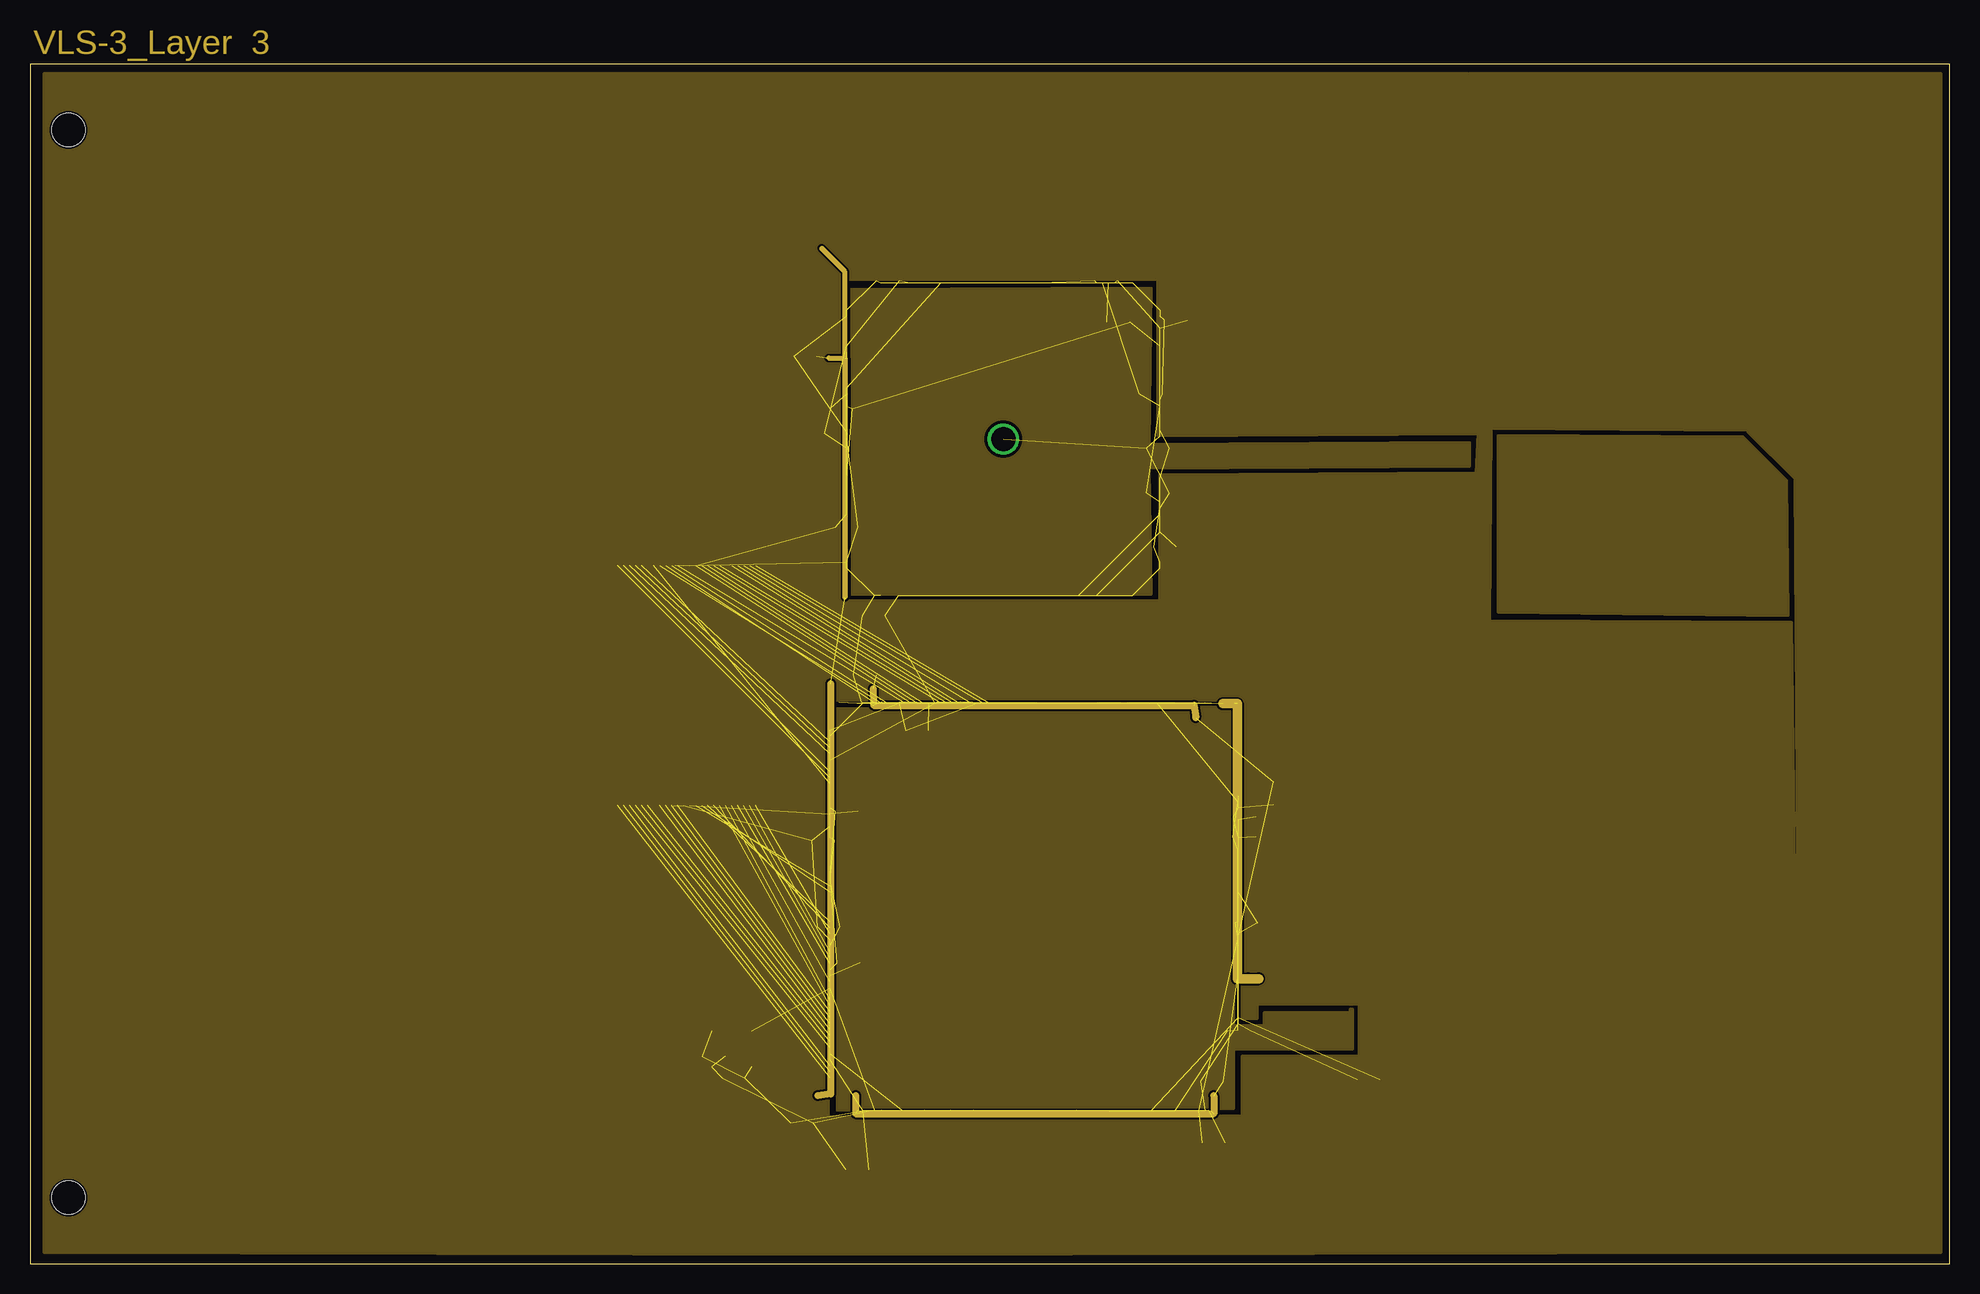
[diagram p11: board, inner layer Route15]
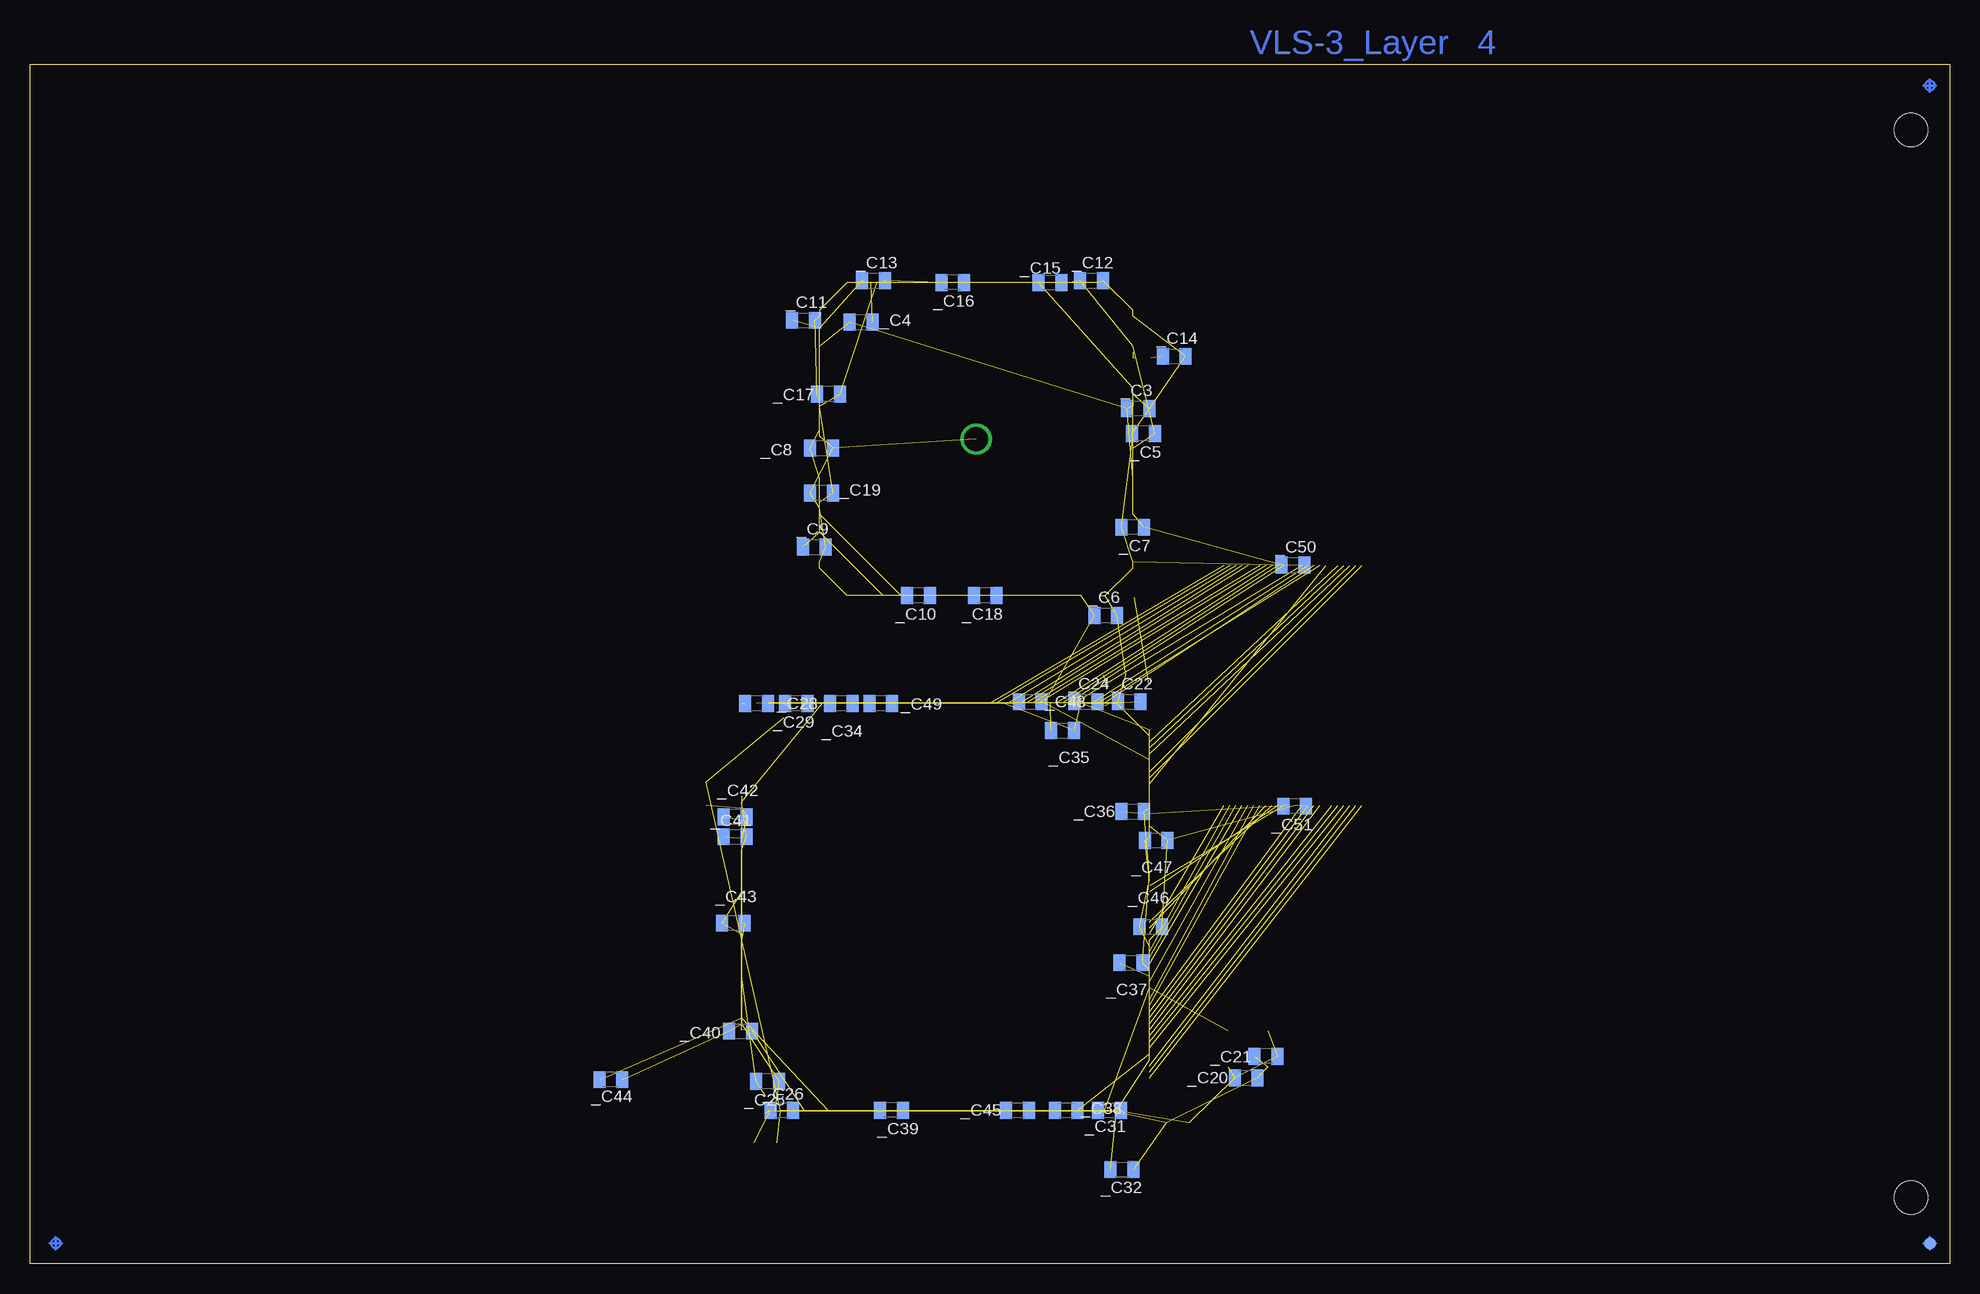
[diagram p12: board, bottom side, seen from below]

Size 160 x 100 mm. Coordinates in mm from the lower left corner, seen from the top.
Copper layers (1*2+15*16): Top 0.035mm / dielectric 1.5mm / Route2 0.035mm / dielectric 0.15mm / Route15 0.035mm / dielectric 0.2mm / Bottom 0.035mm
Design rules "default *": minimum track width 0.15mm, minimum drill 0.3mm, track to track 0.15mm, track to pad 0.15mm, pad to pad 0.15mm, via to via 0.15mm, smd to smd 0.02mm, copper to edge 0.15mm, drill to drill 0.15mm, minimum pad ring 0.25mm, minimum via ring 0.12mm, stop-mask expansion 0.05mm, vias tented up to drill 24mil, thermal gap 10mil

### Footprints (pad centres in the part's own frame; a part is rotated, then mirrored left to right if it is on the bottom)
C0805 = smd 1 x 1.4: 1 -0.95,0; 2 0.95,0
C1210K = smd 1.5 x 2.9: 1 -1.5,0; 2 1.5,0
LQFP-176+GND = smd 1.6 x 0.3: 1 -13.05,10.746; 2 -13.05,10.246; 3 -13.05,9.746; 4 -13.05,9.246; 5 -13.05,8.746; 6 -13.05,8.246; 7 -13.05,7.746; 8 -13.05,7.246; 9 -13.05,6.746; 10 -13.05,6.246; 11 -13.05,5.746; 12 -13.05,5.246; 13 -13.05,4.746; 14 -13.05,4.246; 15 -13.05,3.746; 16 -13.05,3.246; 17 -13.05,2.746; 18 -13.05,2.246; 19 -13.05,1.746; 20 -13.05,1.246; 21 -13.05,0.746; 22 -13.05,0.246; 23 -13.05,-0.254; 24 -13.05,-0.754; 25 -13.05,-1.254; 26 -13.05,-1.754; 27 -13.05,-2.254; 28 -13.05,-2.754; 29 -13.05,-3.254; 30 -13.05,-3.754; 31 -13.05,-4.254; 32 -13.05,-4.754; 33 -13.05,-5.254; 34 -13.05,-5.754; 35 -13.05,-6.254; 36 -13.05,-6.754; 37 -13.05,-7.254; 38 -13.05,-7.754; 39 -13.05,-8.254; 40 -13.05,-8.754; 41 -13.05,-9.254; 42 -13.05,-9.754; 43 -13.05,-10.254; 44 -13.05,-10.754; 89 13.05,-10.75; 90 13.05,-10.25; 91 13.05,-9.75; 92 13.05,-9.25; 93 13.05,-8.75; 94 13.05,-8.25; 95 13.05,-7.75; 96 13.05,-7.25; 97 13.05,-6.75; 98 13.05,-6.25; 99 13.05,-5.75; 100 13.05,-5.25; 101 13.05,-4.75; 102 13.05,-4.25; 103 13.05,-3.75; 104 13.05,-3.25; 105 13.05,-2.75; 106 13.05,-2.25; 107 13.05,-1.75; 108 13.05,-1.25; 109 13.05,-0.75; 110 13.05,-0.25; 111 13.05,0.25; 112 13.05,0.75; 113 13.05,1.25; 114 13.05,1.75; 115 13.05,2.25; 116 13.05,2.75; 117 13.05,3.25; 118 13.05,3.75; 119 13.05,4.25; 120 13.05,4.75; 121 13.05,5.25; 122 13.05,5.75; 123 13.05,6.25; 124 13.05,6.75; 125 13.05,7.25; 126 13.05,7.75; 127 13.05,8.25; 128 13.05,8.75; 129 13.05,9.25; 130 13.05,9.75; 131 13.05,10.25; 132 13.05,10.75 | smd 0.3 x 1.6: 45 -10.75,-13.05; 46 -10.25,-13.05; 47 -9.75,-13.05; 48 -9.25,-13.05; 49 -8.75,-13.05; 50 -8.25,-13.05; 51 -7.75,-13.05; 52 -7.25,-13.05; 53 -6.75,-13.05; 54 -6.25,-13.05; 55 -5.75,-13.05; 56 -5.25,-13.05; 57 -4.75,-13.05; 58 -4.25,-13.05; 59 -3.75,-13.05; 60 -3.25,-13.05; 61 -2.75,-13.05; 62 -2.25,-13.05; 63 -1.75,-13.05; 64 -1.25,-13.05; 65 -0.75,-13.05; 66 -0.25,-13.05; 67 0.25,-13.05; 68 0.75,-13.05; 69 1.25,-13.05; 70 1.75,-13.05; 71 2.25,-13.05; 72 2.75,-13.05; 73 3.25,-13.05; 74 3.75,-13.05; 75 4.25,-13.05; 76 4.75,-13.05; 77 5.25,-13.05; 78 5.75,-13.05; 79 6.25,-13.05; 80 6.75,-13.05; 81 7.25,-13.05; 82 7.75,-13.05; 83 8.25,-13.05; 84 8.75,-13.05; 85 9.25,-13.05; 86 9.75,-13.05; 87 10.25,-13.05; 88 10.75,-13.05; 133 10.75,13.05; 134 10.25,13.05; 135 9.75,13.05; 136 9.25,13.05; 137 8.75,13.05; 138 8.25,13.05; 139 7.75,13.05; 140 7.25,13.05; 141 6.75,13.05; 142 6.25,13.05; 143 5.75,13.05; 144 5.25,13.05; 145 4.75,13.05; 146 4.25,13.05; 147 3.75,13.05; 148 3.25,13.05; 149 2.75,13.05; 150 2.25,13.05; 151 1.75,13.05; 152 1.25,13.05; 153 0.75,13.05; 154 0.25,13.05; 155 -0.25,13.05; 156 -0.75,13.05; 157 -1.25,13.05; 158 -1.75,13.05; 159 -2.25,13.05; 160 -2.75,13.05; 161 -3.25,13.05; 162 -3.75,13.05; 163 -4.25,13.05; 164 -4.75,13.05; 165 -5.25,13.05; 166 -5.75,13.05; 167 -6.25,13.05; 168 -6.75,13.05; 169 -7.25,13.05; 170 -7.75,13.05; 171 -8.25,13.05; 172 -8.75,13.05; 173 -9.25,13.05; 174 -9.75,13.05; 175 -10.25,13.05; 176 -10.75,13.05 | drill 2: CENTER 0,0
PQFP240 = smd 1.5 x 0.32: 1 -17,14.75; 2 -17,14.25; 3 -17,13.75; 4 -17,13.25; 5 -17,12.75; 6 -17,12.25; 7 -17,11.75; 8 -17,11.25; 9 -17,10.75; 10 -17,10.25; 11 -17,9.75; 12 -17,9.25; 13 -17,8.75; 14 -17,8.25; 15 -17,7.75; 16 -17,7.25; 17 -17,6.75; 18 -17,6.25; 19 -17,5.75; 20 -17,5.25; 21 -17,4.75; 22 -17,4.25; 23 -17,3.75; 24 -17,3.25; 25 -17,2.75; 26 -17,2.25; 27 -17,1.75; 28 -17,1.25; 29 -17,0.75; 30 -17,0.25; 31 -17,-0.25; 32 -17,-0.75; 33 -17,-1.25; 34 -17,-1.75; 35 -17,-2.25; 36 -17,-2.75; 37 -17,-3.25; 38 -17,-3.75; 39 -17,-4.25; 40 -17,-4.75; 41 -17,-5.25; 42 -17,-5.75; 43 -17,-6.25; 44 -17,-6.75; 45 -17,-7.25; 46 -17,-7.75; 47 -17,-8.25; 48 -17,-8.75; 49 -17,-9.25; 50 -17,-9.75; 51 -17,-10.25; 52 -17,-10.75; 53 -17,-11.25; 54 -17,-11.75; 55 -17,-12.25; 56 -17,-12.75; 57 -17,-13.25; 58 -17,-13.75; 59 -17,-14.25; 60 -17,-14.75; 121 17,-14.75; 122 17,-14.25; 123 17,-13.75; 124 17,-13.25; 125 17,-12.75; 126 17,-12.25; 127 17,-11.75; 128 17,-11.25; 129 17,-10.75; 130 17,-10.25; 131 17,-9.75; 132 17,-9.25; 133 17,-8.75; 134 17,-8.25; 135 17,-7.75; 136 17,-7.25; 137 17,-6.75; 138 17,-6.25; 139 17,-5.75; 140 17,-5.25; 141 17,-4.75; 142 17,-4.25; 143 17,-3.75; 144 17,-3.25; 145 17,-2.75; 146 17,-2.25; 147 17,-1.75; 148 17,-1.25; 149 17,-0.75; 150 17,-0.25; 151 17,0.25; 152 17,0.75; 153 17,1.25; 154 17,1.75; 155 17,2.25; 156 17,2.75; 157 17,3.25; 158 17,3.75; 159 17,4.25; 160 17,4.75; 161 17,5.25; 162 17,5.75; 163 17,6.25; 164 17,6.75; 165 17,7.25; 166 17,7.75; 167 17,8.25; 168 17,8.75; 169 17,9.25; 170 17,9.75; 171 17,10.25; 172 17,10.75; 173 17,11.25; 174 17,11.75; 175 17,12.25; 176 17,12.75; 177 17,13.25; 178 17,13.75; 179 17,14.25; 180 17,14.75 | smd 0.32 x 1.5: 61 -14.75,-17; 62 -14.25,-17; 63 -13.75,-17; 64 -13.25,-17; 65 -12.75,-17; 66 -12.25,-17; 67 -11.75,-17; 68 -11.25,-17; 69 -10.75,-17; 70 -10.25,-17; 71 -9.75,-17; 72 -9.25,-17; 73 -8.75,-17; 74 -8.25,-17; 75 -7.75,-17; 76 -7.25,-17; 77 -6.75,-17; 78 -6.25,-17; 79 -5.75,-17; 80 -5.25,-17; 81 -4.75,-17; 82 -4.25,-17; 83 -3.75,-17; 84 -3.25,-17; 85 -2.75,-17; 86 -2.25,-17; 87 -1.75,-17; 88 -1.25,-17; 89 -0.75,-17; 90 -0.25,-17; 91 0.25,-17; 92 0.75,-17; 93 1.25,-17; 94 1.75,-17; 95 2.25,-17; 96 2.75,-17; 97 3.25,-17; 98 3.75,-17; 99 4.25,-17; 100 4.75,-17; 101 5.25,-17; 102 5.75,-17; 103 6.25,-17; 104 6.75,-17; 105 7.25,-17; 106 7.75,-17; 107 8.25,-17; 108 8.75,-17; 109 9.25,-17; 110 9.75,-17; 111 10.25,-17; 112 10.75,-17; 113 11.25,-17; 114 11.75,-17; 115 12.25,-17; 116 12.75,-17; 117 13.25,-17; 118 13.75,-17; 119 14.25,-17; 120 14.75,-17; 181 14.75,17; 182 14.25,17; 183 13.75,17; 184 13.25,17; 185 12.75,17; 186 12.25,17; 187 11.75,17; 188 11.25,17; 189 10.75,17; 190 10.25,17; 191 9.75,17; 192 9.25,17; 193 8.75,17; 194 8.25,17; 195 7.75,17; 196 7.25,17; 197 6.75,17; 198 6.25,17; 199 5.75,17; 200 5.25,17; 201 4.75,17; 202 4.25,17; 203 3.75,17; 204 3.25,17; 205 2.75,17; 206 2.25,17; 207 1.75,17; 208 1.25,17; 209 0.75,17; 210 0.25,17; 211 -0.25,17; 212 -0.75,17; 213 -1.25,17; 214 -1.75,17; 215 -2.25,17; 216 -2.75,17; 217 -3.25,17; 218 -3.75,17; 219 -4.25,17; 220 -4.75,17; 221 -5.25,17; 222 -5.75,17; 223 -6.25,17; 224 -6.75,17; 225 -7.25,17; 226 -7.75,17; 227 -8.25,17; 228 -8.75,17; 229 -9.25,17; 230 -9.75,17; 231 -10.25,17; 232 -10.75,17; 233 -11.25,17; 234 -11.75,17; 235 -12.25,17; 236 -12.75,17; 237 -13.25,17; 238 -13.75,17; 239 -14.25,17; 240 -14.75,17
TSOP1-12X20 = smd 1.5 x 0.3: 1 -10,5.75; 2 -10,5.25; 3 -10,4.75; 4 -10,4.25; 5 -10,3.75; 6 -10,3.25; 7 -10,2.75; 8 -10,2.25; 9 -10,1.75; 10 -10,1.25; 11 -10,0.75; 12 -10,0.25; 13 -10,-0.25; 14 -10,-0.75; 15 -10,-1.25; 16 -10,-1.75; 17 -10,-2.25; 18 -10,-2.75; 19 -10,-3.25; 20 -10,-3.75; 21 -10,-4.25; 22 -10,-4.75; 23 -10,-5.25; 24 -10,-5.75; 25 10,-5.75; 26 10,-5.25; 27 10,-4.75; 28 10,-4.25; 29 10,-3.75; 30 10,-3.25; 31 10,-2.75; 32 10,-2.25; 33 10,-1.75; 34 10,-1.25; 35 10,-0.75; 36 10,-0.25; 37 10,0.25; 38 10,0.75; 39 10,1.25; 40 10,1.75; 41 10,2.25; 42 10,2.75; 43 10,3.25; 44 10,3.75; 45 10,4.25; 46 10,4.75; 47 10,5.25; 48 10,5.75
PCB = smd 1 x 1 bottom: S-0.0 0,0 | smd 1 x 1: T-0.0 0,0
EURO = hole 2.794: 1.575,3.81; 1.575,92.812

### Placement (x,y rotation side)
_C3  67.63,71.3 0 bottom
_C4  90.73,78.5 0 bottom
_C5  67.18,69.2 180 bottom
_C6  70.33,54.05 0 bottom
_C7  68.08,61.4 180 bottom
_C8  94.03,68 0 bottom
_C9  94.63,59.75 0 bottom
_C10  85.93,55.7 180 bottom
_C11  95.53,78.65 0 bottom
_C12  71.53,81.95 0 bottom
_C13  89.68,81.95 0 bottom
_C14  64.63,75.65 0 bottom
_C15  74.98,81.8 0 bottom
_C16  83.08,81.8 180 bottom
_C17  93.43,72.5 180 bottom
_C18  80.38,55.7 180 bottom
_C19  94.03,64.25 180 bottom
_C20  58.63,15.5 0 bottom
_C21  56.98,17.3 180 bottom
_C22  68.38,46.85 0 bottom
_C24  71.98,46.85 0 bottom
_C25  98.53,15.2 180 bottom
_C26  97.33,12.8 0 bottom
_C28  99.43,46.7 180 bottom
_C29  96.13,46.7 180 bottom
_C31  70.03,12.8 0 bottom
_C32  68.98,7.85 0 bottom
_C34  92.38,46.7 180 bottom
_C35  73.93,44.45 0 bottom
_C36  68.08,37.7 0 bottom
_C37  68.23,25.1 0 bottom
_C38  73.63,12.8 0 bottom
_C39  88.18,12.8 180 bottom
_C40  100.78,19.4 0 bottom
_C41  101.23,35.6 0 bottom
_C42  101.23,37.25 180 bottom
_C43  101.38,28.4 180 bottom
_C44  111.58,15.35 180 bottom
_C45  77.68,12.8 0 bottom
_C46  66.58,28.1 0 bottom
_C47  66.13,35.3 0 bottom
_C48  76.63,46.85 0 bottom
_C49  89.08,46.7 180 bottom
_C50  54.73,58.25 0 bottom
_C51  54.58,38.15 180 bottom
C39  56.83,17.9 270 top
C44  60.13,17.9 90 top
C45  69.58,49.1 0 top
C46  98.68,10.1 180 top
C47  103.63,39.2 90 top
C48  64.33,11.75 0 top
IC1  81.13,68.75 0 top
IC3  83.68,29.75 270 top
IC15  54.73,48.2 270 top
PCB  1.63,1.7 0 top
U$1  [EURO]  1.63,1.7 0 top

### Tracks (layer width: path | path; a pad name or v marks a point on that pad's centre or on a via)
1V2  (25 unrouted)
  pour Route15 (isolate 0.15): 67.18,46.25 100.33,46.4 100.33,19.85 102.88,19.85 102.88,20.9 110.08,20.9 110.08,21.2 110.23,21.2 110.23,17.9 100.33,17.9 100.33,12.95 67.33,12.8
1V2_PLL  (9 unrouted)
  Route15 0.6: 98.68,14 98.68,12.5 68.83,12.5 68.83,14
  Route15 0.8: 99.43,46.7 100.63,46.7 100.63,24.2 100.63,23.75 101.53,23.75 102.43,23.75
1V4  (15 unrouted)
  pour Route15 (isolate 0.254): 68.38,81.2 93.43,81.35 93.28,68.3 119.98,68.45 119.98,66.5 93.28,66.35 93.43,55.85 68.38,55.85
1V8  (5 unrouted)
2V5  (4 unrouted)
  Route15 0.4: 66.58,75.5 67.93,75.5 67.93,55.55 67.93,82.7 65.98,84.65
  Route15 0.6: 66.73,48.35 66.73,14.15 65.68,14
2V5_VCCA  (15 unrouted)
  Route15 0.6: 70.28,47.95 70.33,46.55 97.03,46.55 97.18,45.5
3V3  (57 unrouted)
  pour Route15 (isolate 0.15): 1.18,99.2 119.83,99.2 119.83,95.45 93.88,95.45 93.88,82.1 67.48,82.1 67.48,55.25 94.18,55.25 94.18,65.75 120.58,65.9 120.73,69.2 94.03,69.05 94.03,95.3 119.98,95.3 119.98,99.2 159.28,99.2 159.28,0.95 147.58,0.95 147.13,65.45 143.23,69.35 143.23,69.5 121.78,69.65 121.63,53.6 146.83,53.45 147.43,0.95 66.73,0.8 66.73,12.2 101.08,12.35 101.08,17.3 110.83,17.3 110.83,21.65 102.28,21.65 102.28,20.45 101.08,20.45 101.08,47 66.43,47 66.58,0.8 1.18,0.95
3V3A
  pour Route15 (isolate 0.254): 122.38,69.05 142.63,68.9 142.78,68.9 146.38,65.3 146.53,54.05 122.38,54.35
GND  (125 unrouted)
  pour Route2 (isolate 0.254): 1.18,98.75 119.98,98.9 158.98,98.9 159.13,1.25 132.43,1.25 132.58,41.75 148.48,41.9 148.18,69.95 121.63,69.8 121.63,53.6 132.28,53.6 132.28,1.25 1.18,1.25
GNDA
  pour Route2 (isolate 0.15): 122.23,69.2 147.58,69.35 147.88,42.5 132.88,42.35 132.88,54.2 122.23,54.2
RA0  (1 unrouted)
RA1  (1 unrouted)
RA2  (1 unrouted)
RA3  (1 unrouted)
RA4  (1 unrouted)
RA5  (1 unrouted)
RA6  (1 unrouted)
RA7  (1 unrouted)
RA8  (1 unrouted)
RA9  (1 unrouted)
RA10  (1 unrouted)
RA11  (1 unrouted)
RA12  (1 unrouted)
RA13  (1 unrouted)
RA14  (1 unrouted)
RA15  (1 unrouted)
RA16  (1 unrouted)
RA17  (1 unrouted)
RA18  (1 unrouted)
RA19  (1 unrouted)
RCS  (1 unrouted)
RD0  (1 unrouted)
RD1  (1 unrouted)
RD2  (1 unrouted)
RD3  (1 unrouted)
RD4  (1 unrouted)
RD5  (1 unrouted)
RD6  (1 unrouted)
RD7  (1 unrouted)
RD8  (1 unrouted)
RD9  (1 unrouted)
RD10  (1 unrouted)
RD11  (1 unrouted)
RD12  (1 unrouted)
RD13  (1 unrouted)
RD14  (1 unrouted)
RD15  (1 unrouted)
RLB  (1 unrouted)
ROE  (1 unrouted)
RUB  (1 unrouted)
RWE  (1 unrouted)

### Text on the board
Top: VLS-3_Layer1
Route2: VLS-2_Layer 2
Route15: VLS-3_Layer 3
Bottom: VLS-3_Layer 4
tStop: VLS-2_Stop S1
bStop: VLS-2_Stop S 2
tCream: VLS-2_Cream CR1
bCream: VLS-2_Cream CR 2
Document: rot gelb | grün gelb